# EAGLE design pp_module_rev_c (EAGLE 6.4)
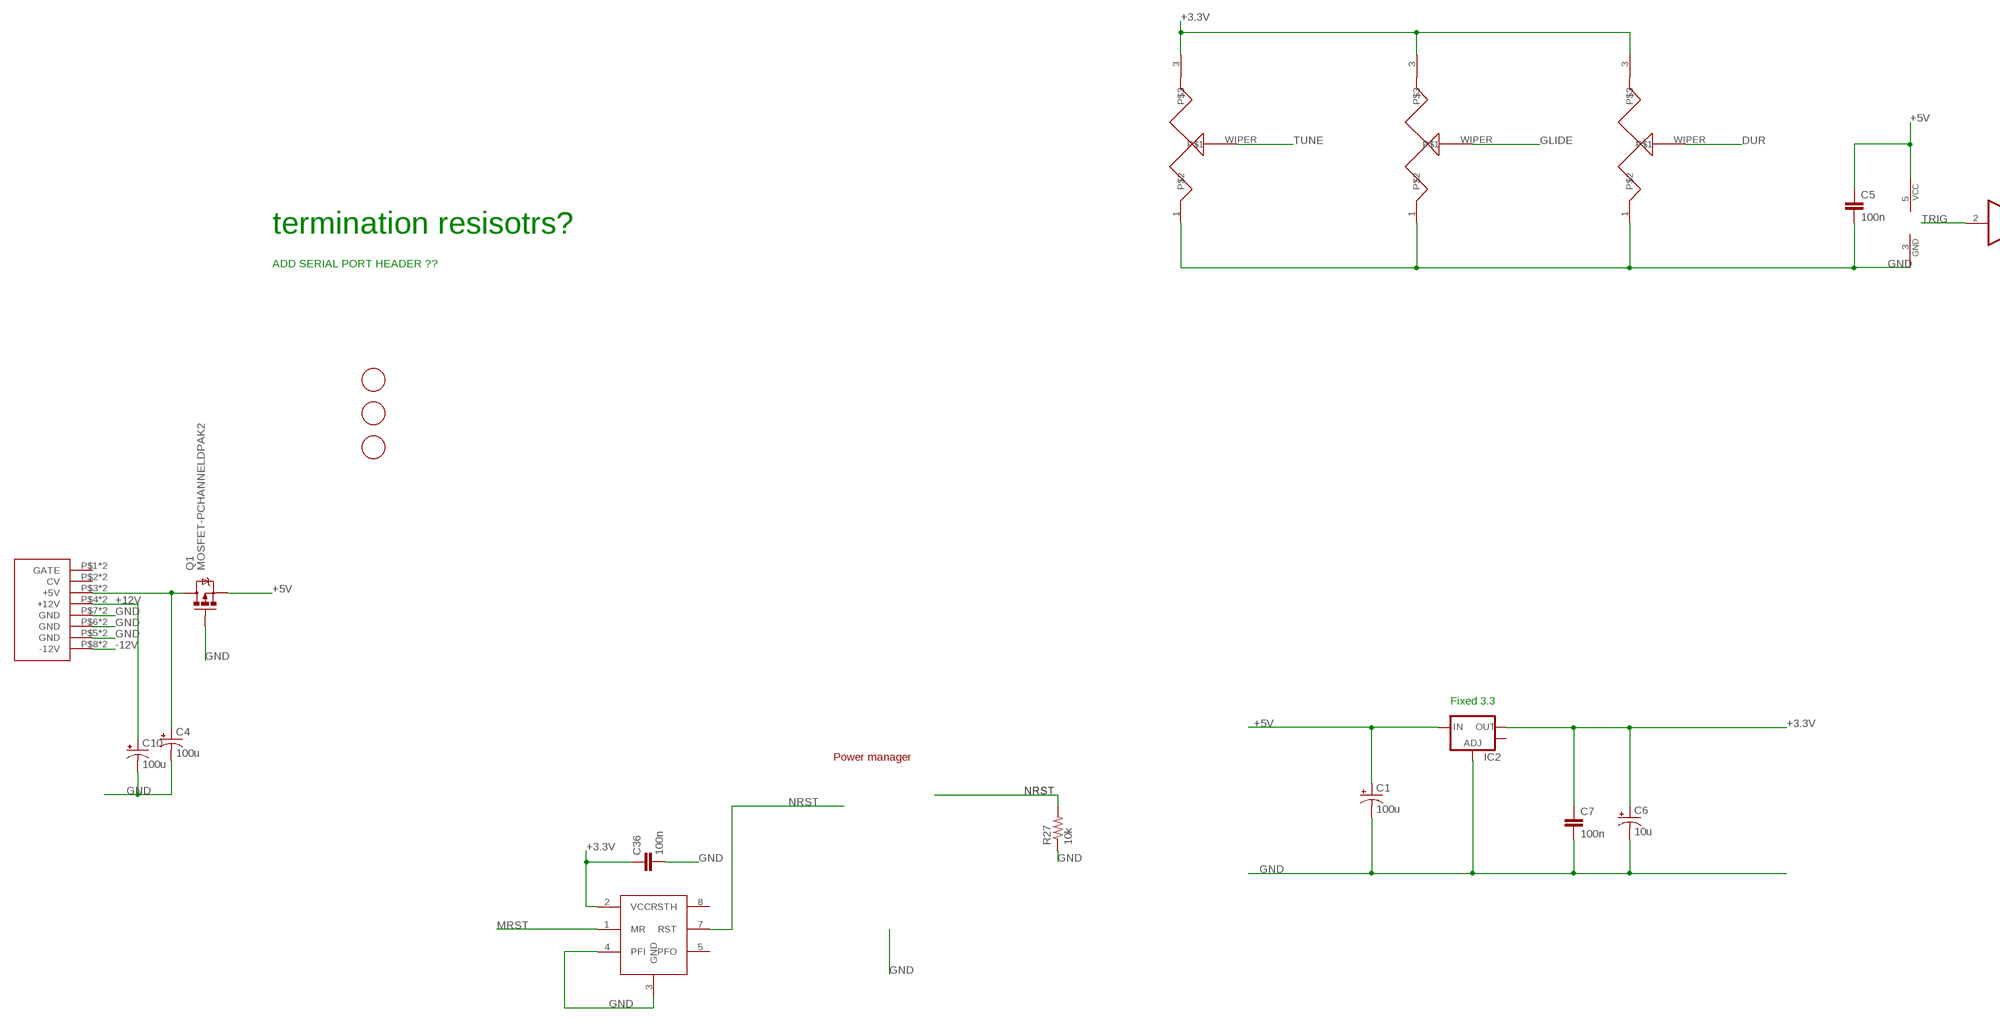
[diagram p0: schematic, sheet 1, part 1 of 3]
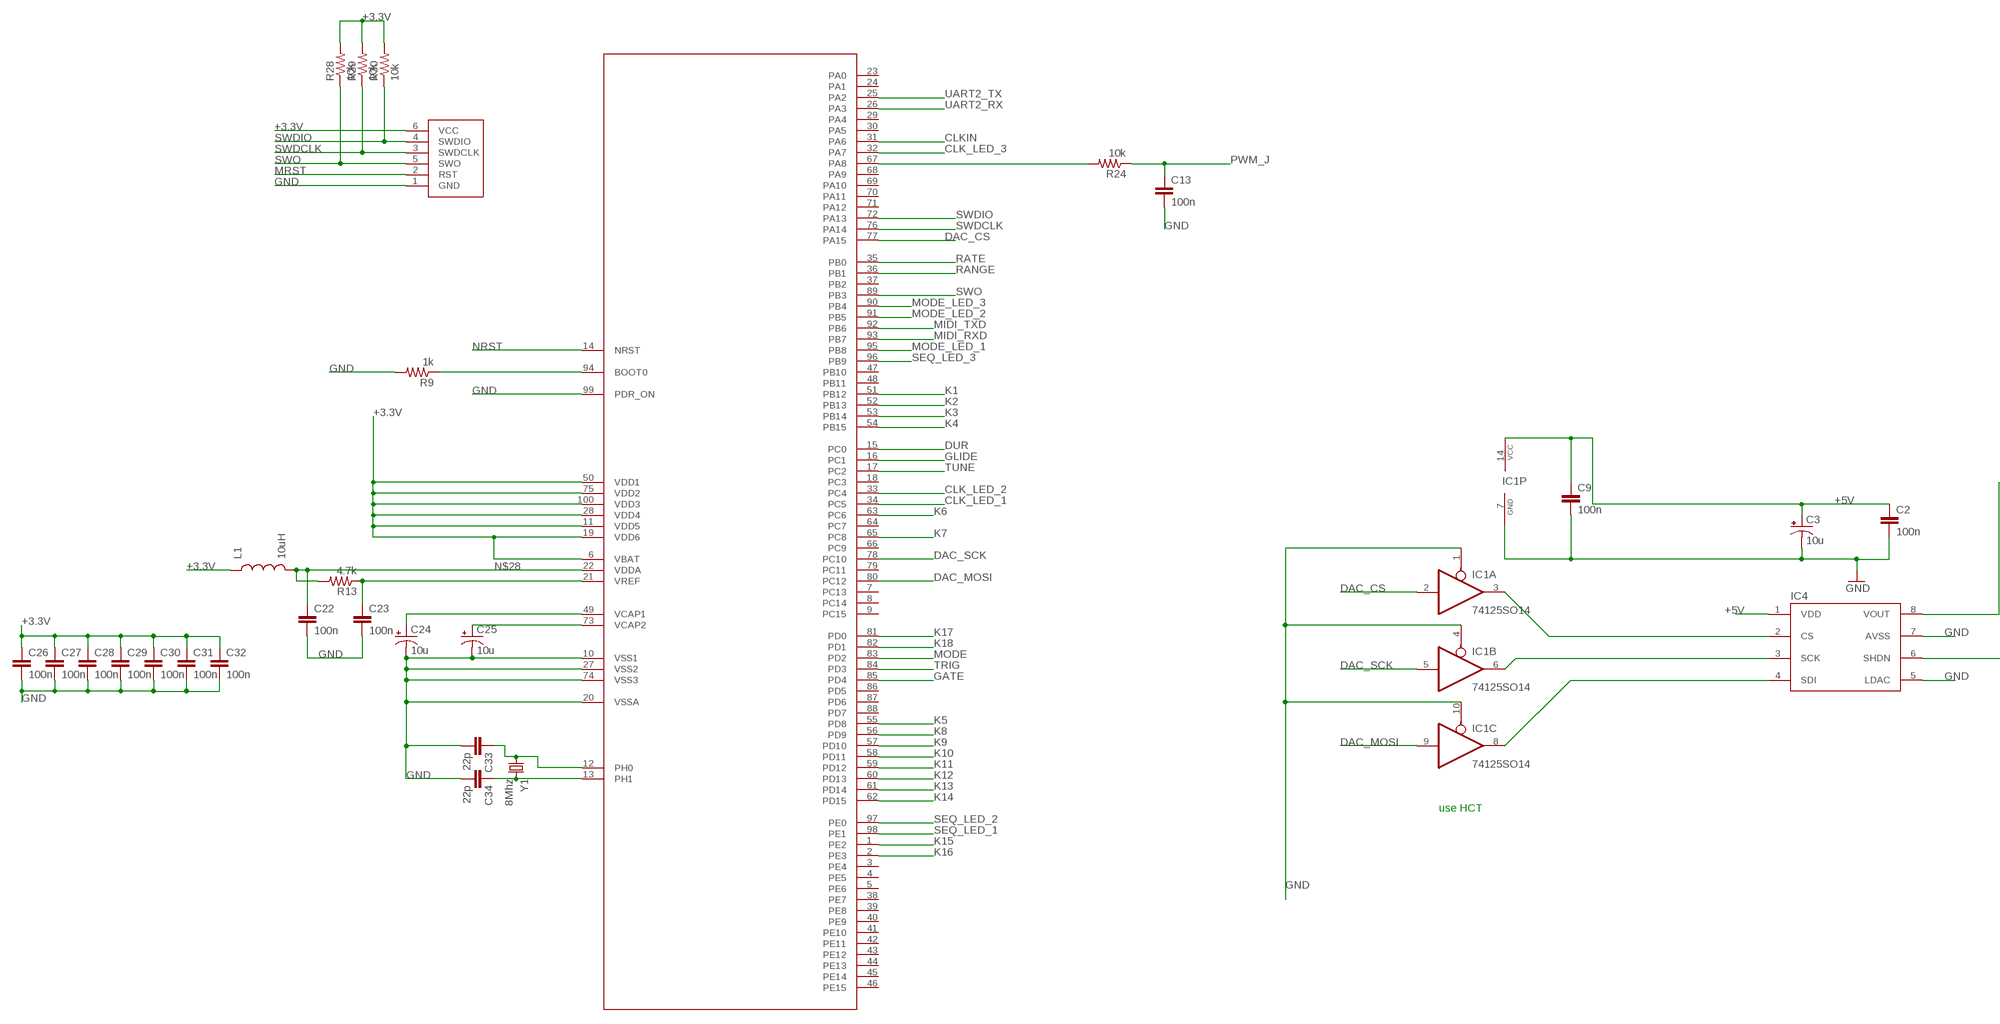
[diagram p1: schematic, sheet 1, part 2 of 3]
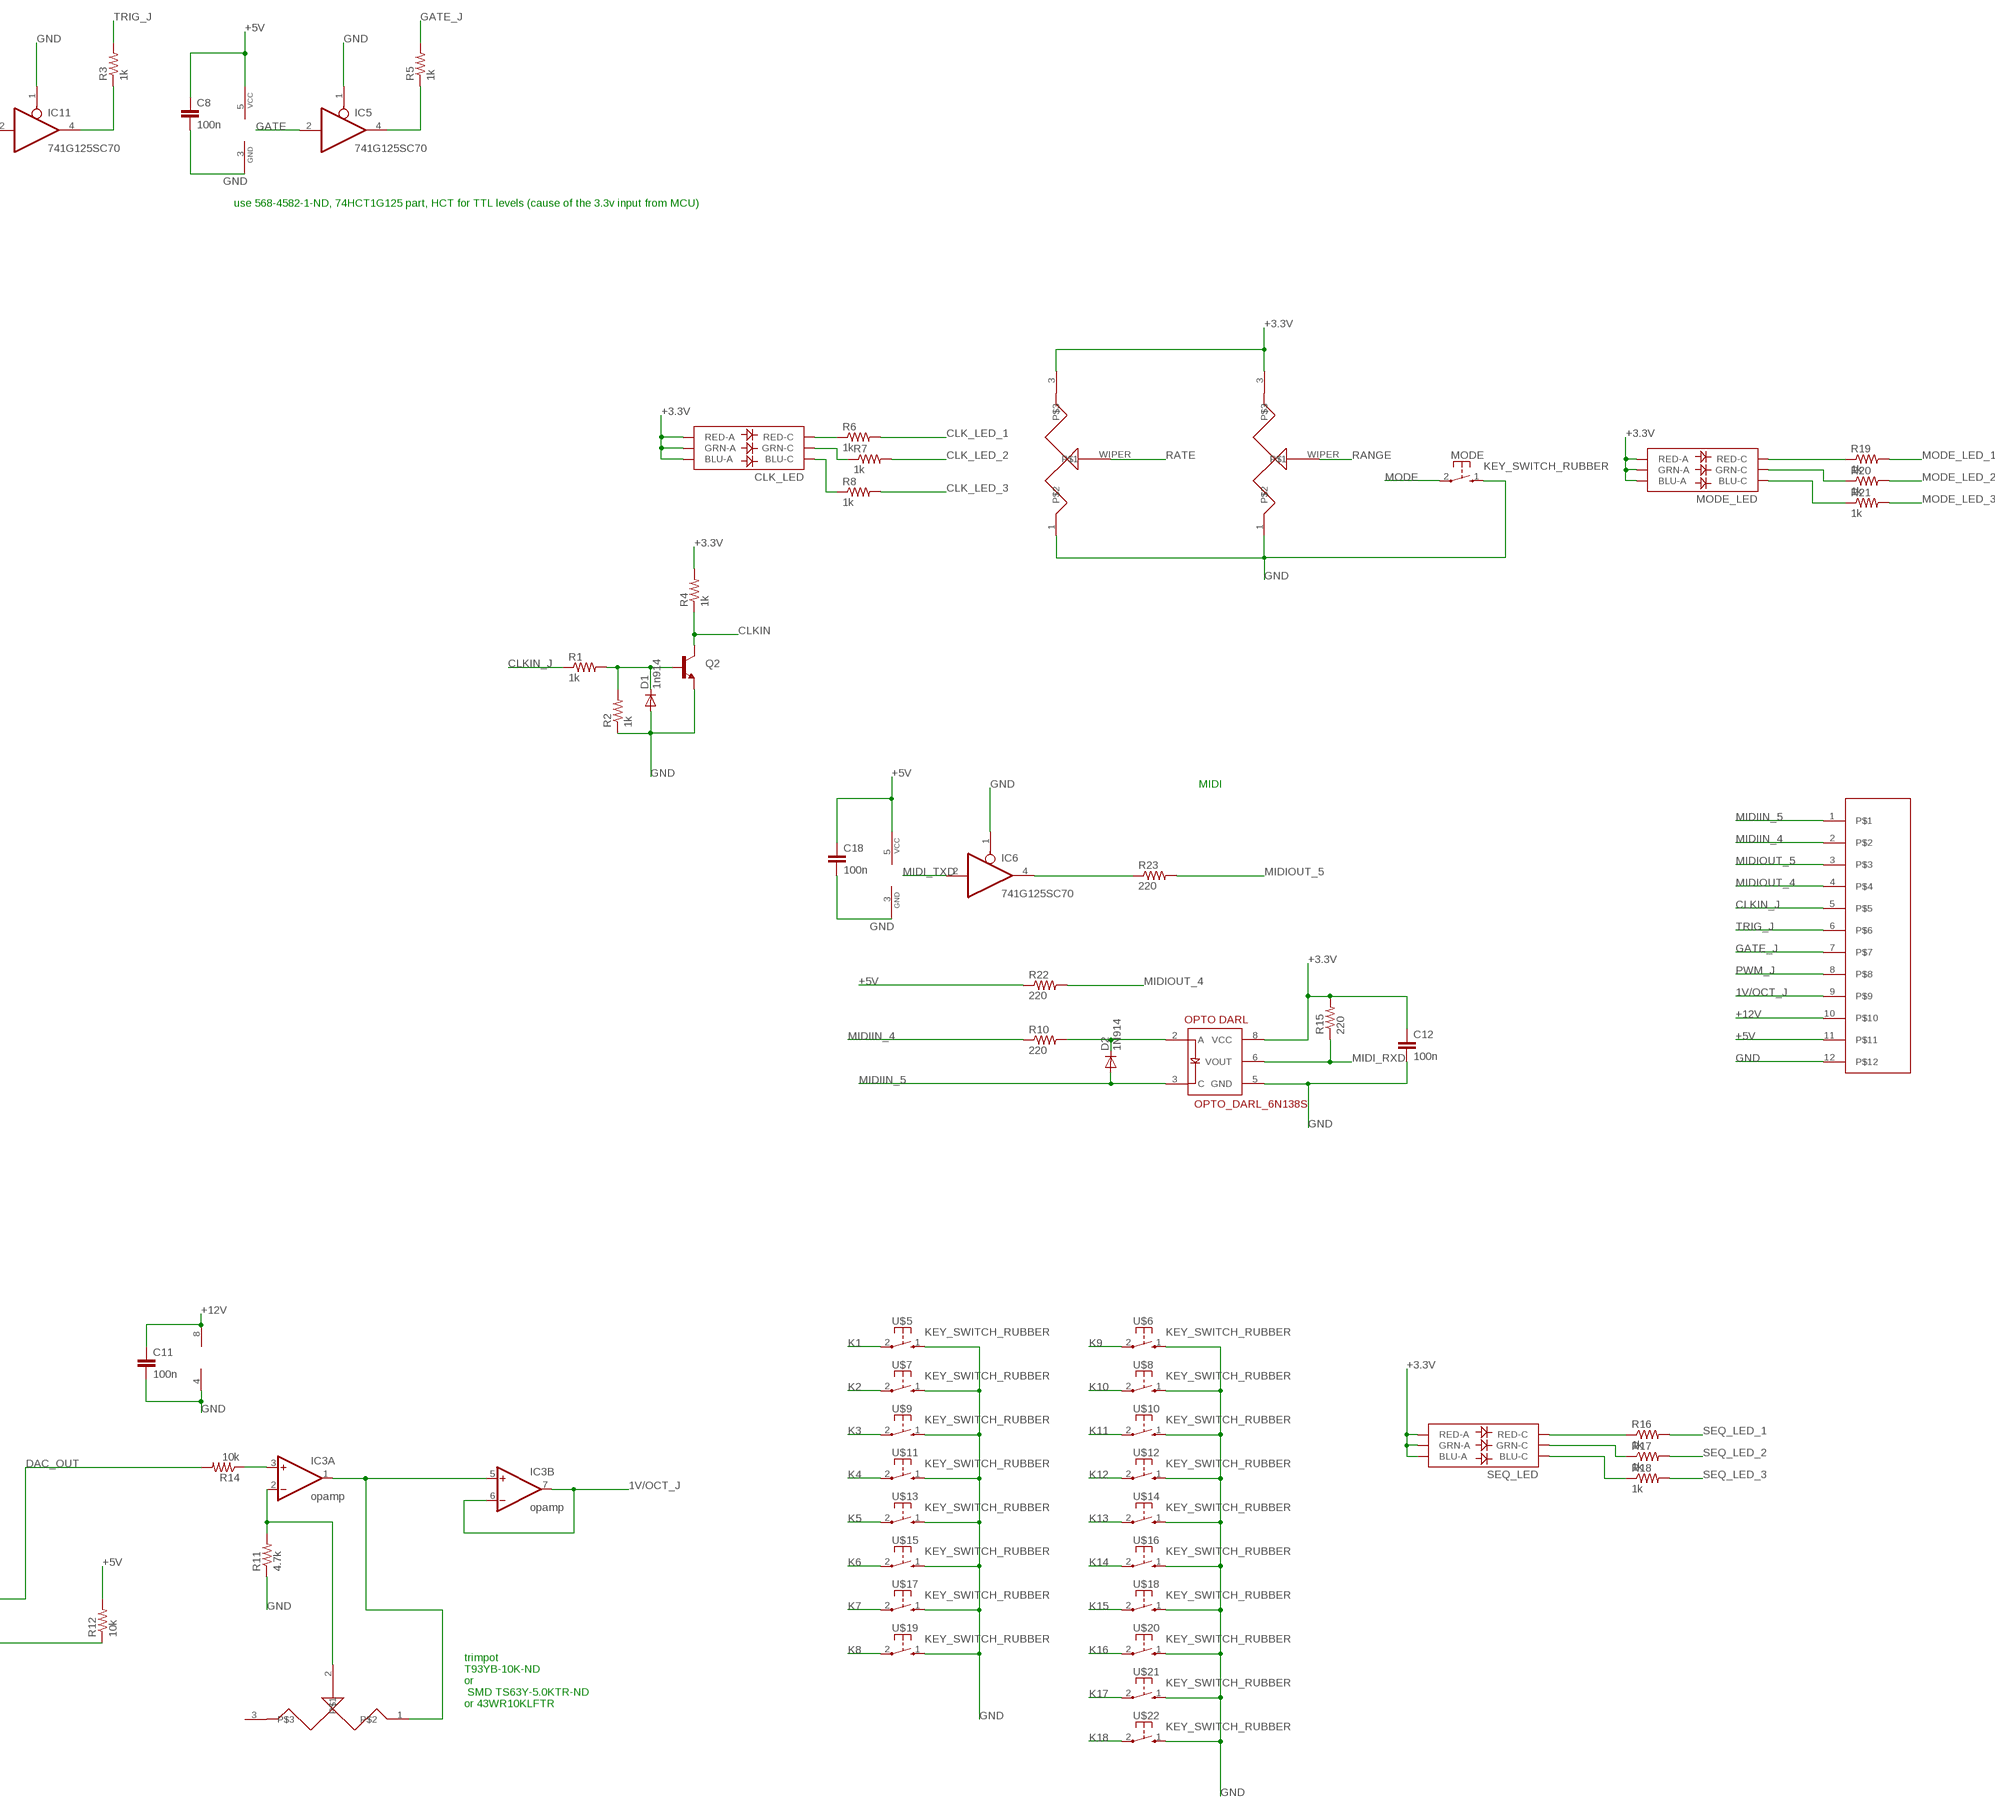
[diagram p2: schematic, sheet 1, part 3 of 3]

## Parts
C1  100u  CAP_POLD  [PANASONIC_D]
C2  100n  CAP0603-CAP  [0603-CAP]
C3  10u  CAP_POL1206  [EIA3216]
C4  100u  CAP_POLD  [PANASONIC_D]
C5  100n  CAP0603-CAP  [0603-CAP]
C6  10u  CAP_POL1206  [EIA3216]
C7  100n  CAP0603-CAP  [0603-CAP]
C8  100n  CAP0603-CAP  [0603-CAP]
C9  100n  CAP0603-CAP  [0603-CAP]
C10  100u  CAP_POLD  [PANASONIC_D]
C11  100n  CAP0603-CAP  [0603-CAP]
C12  100n  CAP0603-CAP  [0603-CAP]
C13  100n  CAP0603-CAP  [0603-CAP]
C18  100n  CAP0603-CAP  [0603-CAP]
C22  100n  CAP0603-CAP  [0603-CAP]
C23  100n  CAP0603-CAP  [0603-CAP]
C24  10u  CAP_POL1206  [EIA3216]
C25  10u  CAP_POL1206  [EIA3216]
C26  100n  CAP0603-CAP  [0603-CAP]
C27  100n  CAP0603-CAP  [0603-CAP]
C28  100n  CAP0603-CAP  [0603-CAP]
C29  100n  CAP0603-CAP  [0603-CAP]
C30  100n  CAP0603-CAP  [0603-CAP]
C31  100n  CAP0603-CAP  [0603-CAP]
C32  100n  CAP0603-CAP  [0603-CAP]
C33  22p  CAP0603-CAP  [0603-CAP]
C34  22p  CAP0603-CAP  [0603-CAP]
C36  100n  CAP0603-CAP  [0603-CAP]
CLK_LED  LED-TRICOLOR-5050  [LED-TRICOLOR-5050]
D1  1n914  DIODESOD  [SOD-323]
D2  1N914  DIODESOD  [SOD-323]
DUR  POTVERT  [POT-P09X-VERT]
GLIDE  POTVERT  [POT-P09X-VERT]
IC1  74125SO14  [SO14]
IC2  V_REG_LM1117SOT223  [SOT223]
IC3  opamp  2AMP_P8+4D  [SO08]
IC4  MCP4821  [SO08]
IC5  741G125SC70  [SC-70]
IC6  741G125SC70  [SC-70]
IC7  STM32F407VGT6  [LQFP100-14X14]
IC9  MAX708  [SO08]
IC11  741G125SC70  [SC-70]
L1  10uH  INDUCTOR0603  [0603]
MODE  KEY_SWITCH_RUBBER  [KEY_CONTACT_RUBBER]
MODE_LED  LED-TRICOLOR-5050  [LED-TRICOLOR-5050]
Q1  MOSFET-PCHANNELDPAK2  [DPAK2]
Q2  TRANSISTOR_NPNSOT23-3  [SOT23-3]
R1  1k  RESISTOR0603-RES  [0603-RES]
R2  1k  RESISTOR0603-RES  [0603-RES]
R3  1k  RESISTOR0603-RES  [0603-RES]
R4  1k  RESISTOR0603-RES  [0603-RES]
R5  1k  RESISTOR0603-RES  [0603-RES]
R6  1k  RESISTOR0603-RES  [0603-RES]
R7  1k  RESISTOR0603-RES  [0603-RES]
R8  1k  RESISTOR0603-RES  [0603-RES]
R9  1k  RESISTOR0603-RES  [0603-RES]
R10  220  RESISTOR0603-RES  [0603-RES]
R11  4.7k  RESISTOR0603-RES  [0603-RES]
R12  10k  RESISTOR0603-RES  [0603-RES]
R13  4.7k  RESISTOR0603-RES  [0603-RES]
R14  10k  RESISTOR0603-RES  [0603-RES]
R15  220  RESISTOR0603-RES  [0603-RES]
R16  1k  RESISTOR0603-RES  [0603-RES]
R17  1k  RESISTOR0603-RES  [0603-RES]
R18  1k  RESISTOR0603-RES  [0603-RES]
R19  1k  RESISTOR0603-RES  [0603-RES]
R20  1k  RESISTOR0603-RES  [0603-RES]
R21  1k  RESISTOR0603-RES  [0603-RES]
R22  220  RESISTOR0603-RES  [0603-RES]
R23  220  RESISTOR0603-RES  [0603-RES]
R24  10k  RESISTOR0603-RES  [0603-RES]
R27  10k  RESISTOR0603-RES  [0603-RES]
R28  10k  RESISTOR0603-RES  [0603-RES]
R29  10k  RESISTOR0603-RES  [0603-RES]
R30  10k  RESISTOR0603-RES  [0603-RES]
RANGE  POTVERT  [POT-P09X-VERT]
RATE  POTVERT  [POT-P09X-VERT]
SEQ_LED  LED-TRICOLOR-5050  [LED-TRICOLOR-5050]
SWD  SWD6PIN  [2X3]
TUNE  POTVERT  [POT-P09X-VERT]
U$1  FIDUCIAL  [FIDUCIAL_1MM]
U$2  POTSMD-TRIMMER  [POT-TRIM-TT-43]
U$3  CARDEDGE_12POS_MALE  [CARDEDGE_12POS_MALE]
U$4  OPTO_DARL_6N138S  [8-SMD]
U$5  KEY_SWITCH_RUBBER  [KEY_CONTACT_RUBBER]
U$6  KEY_SWITCH_RUBBER  [KEY_CONTACT_RUBBER]
U$7  KEY_SWITCH_RUBBER  [KEY_CONTACT_RUBBER]
U$8  KEY_SWITCH_RUBBER  [KEY_CONTACT_RUBBER]
U$9  KEY_SWITCH_RUBBER  [KEY_CONTACT_RUBBER]
U$10  KEY_SWITCH_RUBBER  [KEY_CONTACT_RUBBER]
U$11  KEY_SWITCH_RUBBER  [KEY_CONTACT_RUBBER]
U$12  KEY_SWITCH_RUBBER  [KEY_CONTACT_RUBBER]
U$13  KEY_SWITCH_RUBBER  [KEY_CONTACT_RUBBER]
U$14  KEY_SWITCH_RUBBER  [KEY_CONTACT_RUBBER]
U$15  KEY_SWITCH_RUBBER  [KEY_CONTACT_RUBBER]
U$16  KEY_SWITCH_RUBBER  [KEY_CONTACT_RUBBER]
U$17  KEY_SWITCH_RUBBER  [KEY_CONTACT_RUBBER]
U$18  KEY_SWITCH_RUBBER  [KEY_CONTACT_RUBBER]
U$19  KEY_SWITCH_RUBBER  [KEY_CONTACT_RUBBER]
U$20  KEY_SWITCH_RUBBER  [KEY_CONTACT_RUBBER]
U$21  KEY_SWITCH_RUBBER  [KEY_CONTACT_RUBBER]
U$22  KEY_SWITCH_RUBBER  [KEY_CONTACT_RUBBER]
U$23  FIDUCIAL  [FIDUCIAL_1MM]
U$24  FIDUCIAL  [FIDUCIAL_1MM]
U$33  DOEPFER_16_CONNSMD  [2X8SMD]
Y1  8Mhz  CRYSTALABA  [CRYSTAL-SMD]

## Nets
1N914: D1.1(C) Q2.1(B) R1.2 R2.2
1V/OCT_J: IC3.6(B:-IN) IC3.7(B:OUT) U$3.9
+3.3V [power]: C6.A(+) C7.1 C12.1 C26.1 C27.1 C28.1 C29.1 C30.1 C31.1 C32.1 C36.1 CLK_LED.1(BLU-A) CLK_LED.3(GRN-A) CLK_LED.5(RED-A) DUR.3 GLIDE.3 IC2.2(OUT) IC7.6(VBAT) IC7.11(VDD5) IC7.19(VDD6) IC7.28(VDD4) IC7.50(VDD1) IC7.75(VDD2) IC7.100(VDD3) IC9.2(VCC) L1.1 MODE_LED.1(BLU-A) MODE_LED.3(GRN-A) MODE_LED.5(RED-A) R4.2 R15.2 R28.2 R29.2 R30.2 RANGE.3 RATE.3 SEQ_LED.1(BLU-A) SEQ_LED.3(GRN-A) SEQ_LED.5(RED-A) SWD.6(VCC) TUNE.3 U$4.8(VCC)
+5V [power]: C1.+ C2.1 C3.A(+) C5.1 C8.1 C9.1 C18.1 IC1.14(P:VCC) IC2.3(IN) IC4.1(VDD) IC5.5(VCC) IC6.5(VCC) IC11.5(VCC) Q1.3(S) R12.2 R22.1 U$3.11
+12V: C10.+ C11.1 IC3.8(P:V+) U$3.10 U$33.P$4(+12V) U$33.P$12(+12V)
-12V: U$33.P$8(-12V) U$33.P$16(-12V)
CLK_LED_1: IC7.34(PC5) R6.2
CLK_LED_2: IC7.33(PC4) R7.2
CLK_LED_3: IC7.32(PA7) R8.2
CLKIN: IC7.31(PA6) Q2.3(C) R4.1
CLKIN_J: R1.1 U$3.5
DAC_CS: IC1.2(A:I) IC7.77(PA15)
DAC_MOSI: IC1.9(C:I) IC7.80(PC12)
DAC_OUT: IC4.8(VOUT) R14.2
DAC_SCK: IC1.5(B:I) IC7.78(PC10)
DUR: DUR.WIPER IC7.15(PC0)
GATE: IC5.2(I) IC7.85(PD4)
GATE_J: R5.2 U$3.7
GLIDE: GLIDE.WIPER IC7.16(PC1)
GND: C1.- C2.2 C3.C(-) C4.- C5.2 C6.C(-) C7.2 C8.2 C9.2 C10.- C11.2 C12.2 C13.2 C18.2 C22.2 C23.2 C24.C(-) C25.C(-) C26.2 C27.2 C28.2 C29.2 C30.2 C31.2 C32.2 C33.2 C34.2 C36.2 D1.2(A) DUR.1 GLIDE.1 IC1.1(A:OE) IC1.4(B:OE) IC1.7(P:GND) IC1.10(C:OE) IC2.1(ADJ) IC3.4(P:V-) IC4.5(LDAC) IC4.7(AVSS) IC5.1(OE) IC5.3(GND) IC6.1(OE) IC6.3(GND) IC7.10(VSS1) IC7.20(VSSA) IC7.27(VSS2) IC7.74(VSS3) IC7.99(PDR_ON) IC9.3(GND) IC9.4(PFI) IC11.1(OE) IC11.3(GND) MODE.1 Q1.1(G) Q2.2(E) R2.1 R9.2 R11.1 R27.1 RANGE.1 RATE.1 SWD.1(GND) TUNE.1 U$3.12 U$4.5(GND) U$5.1 U$6.1 U$7.1 U$8.1 U$9.1 U$10.1 U$11.1 U$12.1 U$13.1 U$14.1 U$15.1 U$16.1 U$17.1 U$18.1 U$19.1 U$20.1 U$21.1 U$22.1 U$33.P$5(GND) U$33.P$6(GND) U$33.P$7(GND) U$33.P$13(GND) U$33.P$14(GND) U$33.P$15(GND)
K1: IC7.51(PB12) U$5.2
K2: IC7.52(PB13) U$7.2
K3: IC7.53(PB14) U$9.2
K4: IC7.54(PB15) U$11.2
K5: IC7.55(PD8) U$13.2
K6: IC7.63(PC6) U$15.2
K7: IC7.65(PC8) U$17.2
K8: IC7.56(PD9) U$19.2
K9: IC7.57(PD10) U$6.2
K10: IC7.58(PD11) U$8.2
K11: IC7.59(PD12) U$10.2
K12: IC7.60(PD13) U$12.2
K13: IC7.61(PD14) U$14.2
K14: IC7.62(PD15) U$16.2
K15: IC7.1(PE2) U$18.2
K16: IC7.2(PE3) U$20.2
K17: IC7.81(PD0) U$21.2
K18: IC7.82(PD1) U$22.2
MIDI_RXD: IC7.93(PB7) R15.1 U$4.6(VOUT)
MIDI_TXD: IC6.2(I) IC7.92(PB6)
MIDIIN_4: R10.1 U$3.2
MIDIIN_5: D2.2(A) U$3.1 U$4.3(C)
MIDIOUT_4: R22.2 U$3.4
MIDIOUT_5: R23.2 U$3.3
MODE: IC7.83(PD2) MODE.2
MODE_LED_1: IC7.95(PB8) R19.2
MODE_LED_2: IC7.91(PB5) R20.2
MODE_LED_3: IC7.90(PB4) R21.2
MRST: IC9.1(MR) SWD.2(RST)
N$1: MODE_LED.6(RED-C) R19.1
N$2: MODE_LED.4(GRN-C) R20.1
N$3: C34.1 IC7.13(PH1) Y1.2
N$4: MODE_LED.2(BLU-C) R21.1
N$5: C24.A(+) IC7.49(VCAP1)
N$6: C33.1 IC7.12(PH0) Y1.1
N$7: IC3.2(A:-IN) R11.2 U$2.2
N$8: IC3.3(A:+IN) R14.1
N$9: C4.+ Q1.4(D) U$33.P$3(+5V) U$33.P$11(+5V)
N$10: IC11.4(O) R3.1
N$11: CLK_LED.6(RED-C) R6.1
N$12: IC5.4(O) R5.1
N$13: IC7.67(PA8) R24.2
N$14: CLK_LED.4(GRN-C) R7.1
N$15: CLK_LED.2(BLU-C) R8.1
N$17: C25.A(+) IC7.73(VCAP2)
N$18: IC4.6(SHDN) R12.1
N$19: R18.1 SEQ_LED.2(BLU-C)
N$20: R17.1 SEQ_LED.4(GRN-C)
N$21: IC7.94(BOOT0) R9.1
N$22: R16.1 SEQ_LED.6(RED-C)
N$24: IC3.1(A:OUT) IC3.5(B:+IN) U$2.1
N$27: IC1.3(A:O) IC4.2(CS)
N$28: C22.1 IC7.22(VDDA) L1.2 R13.2
N$29: C23.1 IC7.21(VREF) R13.1
N$30: D2.1(C) R10.2 U$4.2(A)
N$34: IC6.4(O) R23.1
N$36: IC1.6(B:O) IC4.3(SCK)
N$37: IC1.8(C:O) IC4.4(SDI)
NRST: IC7.14(NRST) IC9.7(RST) R27.2
PWM_J: C13.1 R24.1 U$3.8
RANGE: IC7.36(PB1) RANGE.WIPER
RATE: IC7.35(PB0) RATE.WIPER
SEQ_LED_1: IC7.98(PE1) R16.2
SEQ_LED_2: IC7.97(PE0) R17.2
SEQ_LED_3: IC7.96(PB9) R18.2
SWDCLK: IC7.76(PA14) R29.1 SWD.3(SWDCLK)
SWDIO: IC7.72(PA13) R30.1 SWD.4(SWDIO)
SWO: IC7.89(PB3) R28.1 SWD.5(SWO)
TRIG: IC7.84(PD3) IC11.2(I)
TRIG_J: R3.2 U$3.6
TUNE: IC7.17(PC2) TUNE.WIPER
UART2_RX: IC7.26(PA3)
UART2_TX: IC7.25(PA2)
Unconnected: IC1.11(D:O) IC1.12(D:I) IC1.13(D:OE) IC2.4(OUT) IC7.3(PE4) IC7.4(PE5) IC7.5(PE6) IC7.7(PC13) IC7.8(PC14) IC7.9(PC15) IC7.18(PC3) IC7.23(PA0) IC7.24(PA1) IC7.29(PA4) IC7.30(PA5) IC7.37(PB2) IC7.38(PE7) IC7.39(PE8) IC7.40(PE9) IC7.41(PE10) IC7.42(PE11) IC7.43(PE12) IC7.44(PE13) IC7.45(PE14) IC7.46(PE15) IC7.47(PB10) IC7.48(PB11) IC7.64(PC7) IC7.66(PC9) IC7.68(PA9) IC7.69(PA10) IC7.70(PA11) IC7.71(PA12) IC7.79(PC11) IC7.86(PD5) IC7.87(PD6) IC7.88(PD7) IC9.5(PFO) IC9.8(RSTH) U$2.3 U$33.P$1(GATE) U$33.P$2(CV) U$33.P$9(GATE) U$33.P$10(CV)

## Notes on the sheet
- termination resisotrs?
- ADD SERIAL PORT HEADER ??
- use 568-4582-1-ND, 74HCT1G125 part, HCT for TTL levels (cause of the 3.3v input from MCU)
- Fixed 3.3
- Power manager
- MIDI
- trimpot 
  T93YB-10K-ND
  or 
   SMD TS63Y-5.0KTR-ND
  or 43WR10KLFTR
- use HCT

## Library data of the parts
C1 C4 C10 = osborn:CAP_POL: Capacitor Polarized These are standard SMD and PTH capacitors. Normally 10uF, 47uF, and 100uF in electrolytic and tantalum varieties. Always verify the external diameter of the through hole cap, it varies with capacity, voltage, and manufacturer. The EIA devices should be standard.; CID: 68
C2 C5 C8 C9 C11-C13 C18 C22 C23 C26-C32 C36 = osborn:CAP: Capacitor Standard 0603 ceramic capacitor, and 0.1" leaded capacitor.; CID: 67
C3 C6 C24 C25 = osborn:CAP_POL: Capacitor Polarized These are standard SMD and PTH capacitors. Normally 10uF, 47uF, and 100uF in electrolytic and tantalum varieties. Always verify the external diameter of the through hole cap, it varies with capacity, voltage, and manufacturer. The EIA devices should be standard.; CID: 70
C7 = osborn:CAP: Capacitor Standard 0603 ceramic capacitor, and 0.1" leaded capacitor.
C33 C34 = osborn:CAP: Capacitor Standard 0603 ceramic capacitor, and 0.1" leaded capacitor.; CID: 75
CLK_LED MODE_LED SEQ_LED = osborn:LED-TRICOLOR-5050; CID: 27
D1 D2 = osborn:DIODE: Diode These are standard reverse protection diodes and small signal diodes. SMA package can handle up to about 1A. SOD-323 can handle about 200mA. What the SOD-323 package when ordering, there are some mfgs out there that are 5-pin packages.; CID: 90
DUR GLIDE RANGE RATE TUNE = osborn:POT; CID: 161
IC1 = osborn:74*125: Quad bus BUFFER, 3-state; CID: 164
IC2 = osborn:V_REG_LM1117: Voltage Regulator LM1117 Standard adjustable voltage regulator but in SMD form. Spark Fun Electronics SKU : COM-00595; CID: 121
IC3 = osborn:2AMP_P8+4: OP AMP; CID: 168
IC4 = osborn:MCP4821; CID: 162
IC5 IC6 IC11 = osborn:741G125; CID: 165
IC7 = osborn:STM32F407VGT6; CID: 126; DIGIKEY: 497-11605-ND; MOUSER: 511-STM32F407VGT6
IC9 = osborn:MAX708; CID: 128
L1 = osborn:INDUCTOR: Inductors Basic Inductor/Choke - 0603 and 1206. Footprints are not proven and vary greatly between part numbers.; CID: 129
MODE U$5-U$22 = osborn:KEY_SWITCH_RUBBER
Q1 = osborn:MOSFET-PCHANNEL; CID: 130
Q2 = osborn:TRANSISTOR_NPN: Transistor NPN BJT configuration in SOT23 package. MMBT2222 is the common NPN we use. Double check BCE configuration again layout.; CID: 167
R1 R2 R4 R6-R9 R16-R21 = osborn:RESISTOR: Resistor Basic schematic elements and footprints for 0603, 1206, and PTH resistors.; CID: 72
R3 R5 = osborn:RESISTOR: Resistor Basic schematic elements and footprints for 0603, 1206, and PTH resistors.; CID: 102
R10 R15 R22 R23 = osborn:RESISTOR: Resistor Basic schematic elements and footprints for 0603, 1206, and PTH resistors.; CID: 108
R11 R13 = osborn:RESISTOR: Resistor Basic schematic elements and footprints for 0603, 1206, and PTH resistors.; CID: 78
R12 = osborn:RESISTOR: Resistor Basic schematic elements and footprints for 0603, 1206, and PTH resistors.
R14 = osborn:RESISTOR: Resistor Basic schematic elements and footprints for 0603, 1206, and PTH resistors.; CID: 105
R24 R27-R30 = osborn:RESISTOR: Resistor Basic schematic elements and footprints for 0603, 1206, and PTH resistors.; CID: 69
SWD = osborn:SWD
U$1 U$23 U$24 = osborn:FIDUCIAL: For use by pick and place machines to calibrate the vision/machine, 1mm By microbuilder.eu
U$2 = osborn:POT; CID: 166
U$3 = osborn:CARDEDGE_12POS_MALE
U$4 = SparkFun-20110623:OPTO_DARL_6N138S; CID: 91
U$33 = osborn:DOEPFER_16_CONN; CID: 163
Y1 = osborn:CRYSTAL: Crystals Various standard crystals. Proven footprints. Spark Fun Electronics SKU : COM-00534; CID: 140

## Net classes
0 default: width 0.254 mm
1 power: width 0.254 mm

## Board
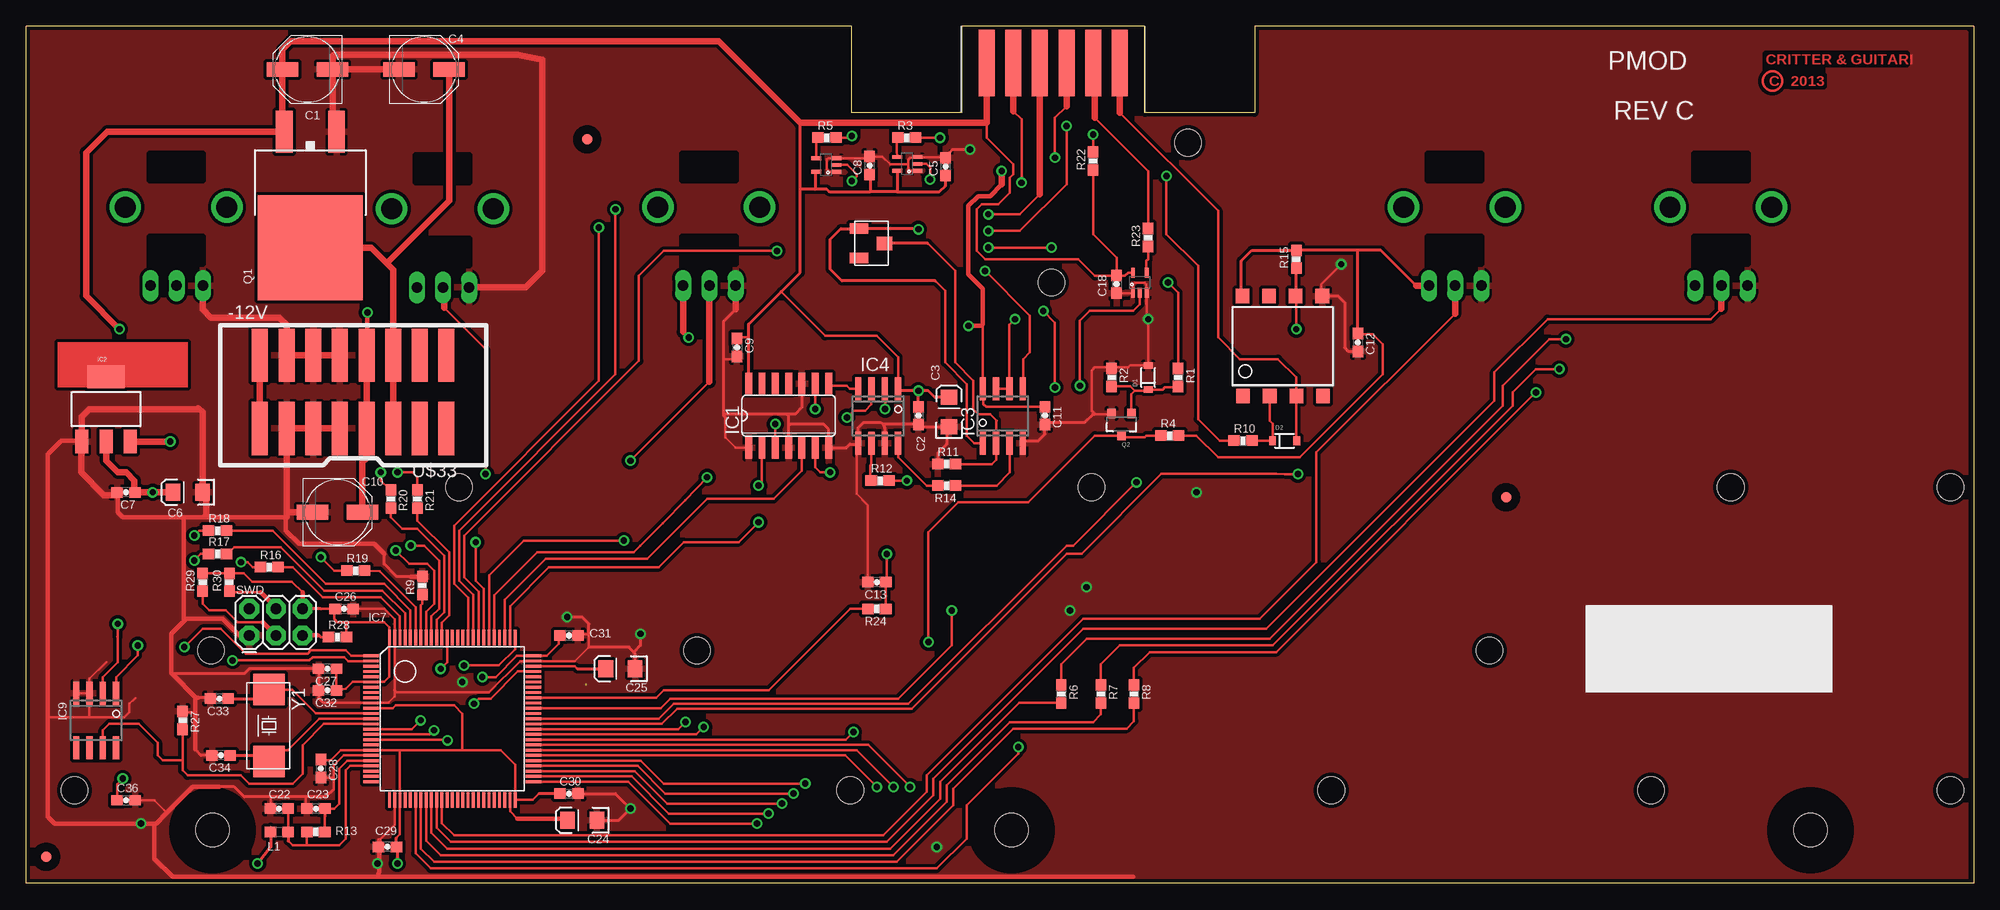
[diagram p3: board, top side]
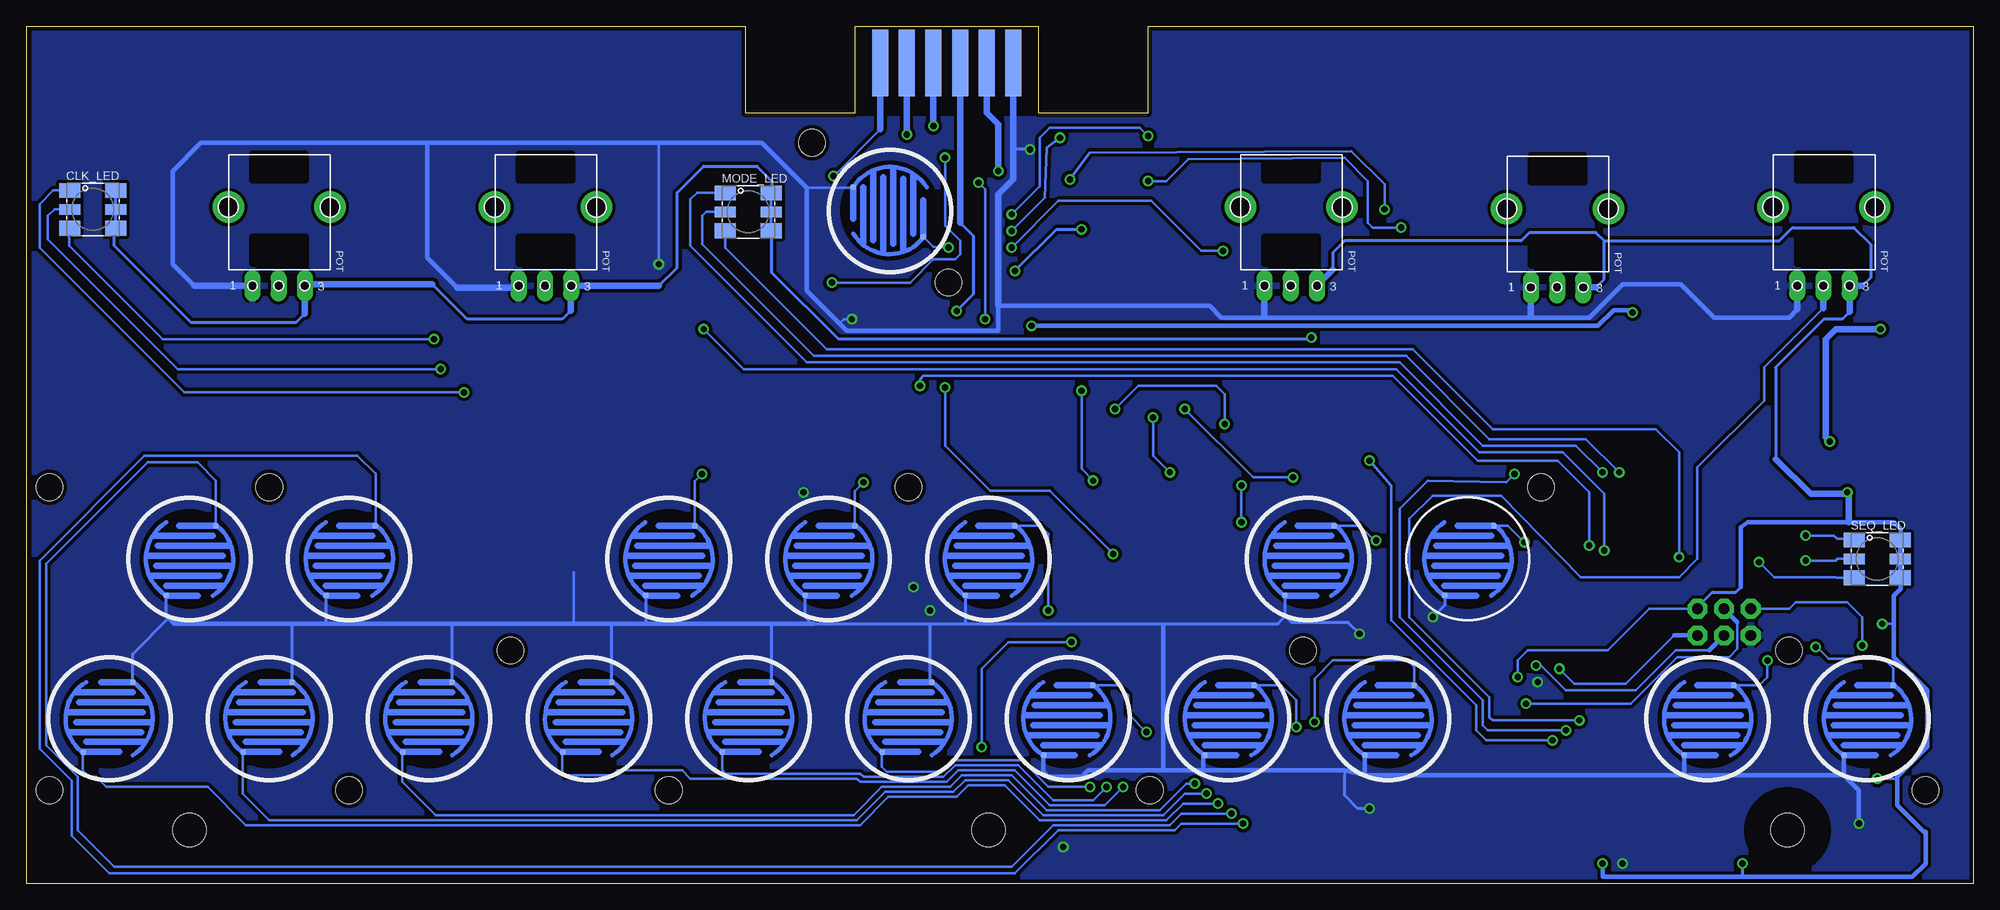
[diagram p4: board, bottom side, seen from below]

Size 185.74 x 81.76 mm. Coordinates in mm from the lower left corner, seen from the top.
Outline: 185.74,81.76 185.74,0 0,0 0,81.76 78.74,81.76 78.74,73.5 89.22,73.5 89.22,81.76 106.68,81.76 106.68,73.5 117.16,73.5 117.16,81.76 185.74,81.76
Copper layers (1*16): Top 0.035mm / dielectric 1.5mm / Bottom 0.035mm
Design rules "default": minimum track width 10mil, minimum drill 20mil, track to track 8mil, track to pad 8mil, pad to pad 8mil, via to via 8mil, smd to smd 8mil, copper to edge 15mil, drill to drill 8mil, minimum pad ring 10mil, minimum via ring 8mil, stop-mask expansion 4mil, vias tented up to drill 0mil, thermal gap 10mil
Holes 3.2 mm at 170.17,5.09 17.77,5.09 93.97,5.09
Holes 2.54 mm at 139.54,22.23 63.98,22.23 17.62,22.23 162.56,37.78 101.6,37.78 154.94,8.89 124.46,8.89 78.58,8.89 4.6,8.89 183.52,8.89 183.52,37.78 41.28,37.78 110.81,70.64 97.79,57.31
tRestrict: area 14,1.3 to 21.6,8.9; area 90.2,1.3 to 97.8,8.9; area 166.4,1.3 to 174,8.9
bRestrict: area 14,1.3 to 21.6,8.9; area 90.2,1.3 to 97.8,8.9; area 166.4,1.3 to 174,8.9

### Footprints (pad centres in the part's own frame; a part is rotated, then mirrored left to right if it is on the bottom)
PANASONIC_D = smd 3 x 1.4: + 2.4,0; - -2.4,0
0603-CAP = smd 1.1 x 1: 1 -0.85,0; 2 0.85,0
EIA3216 = smd 1.4 x 1.6: A 1.4,0; C -1.4,0
LED-TRICOLOR-5050 = smd 2 x 1.4: 1 2.2,1.8; 2 -2.2,1.8; 5 2.2,-1.8; 6 -2.2,-1.8 | smd 2 x 1: 3 2.2,0; 4 -2.2,0
SOD-323 = smd 0.63 x 0.83: 1 -1.15,0; 2 1.15,0
POT-P09X-VERT = drill 1 pad 1.27 long: 1 -2.54,-7.51; 3 2.46,-7.51; WIPER -0.04,-7.51 | drill 2 pad 2.54: P$4 4.86,-0.01; P$5 -4.84,-0.01
SO14 = smd 0.66 x 2.032: 1 -3.81,-3.073; 2 -2.54,-3.073; 3 -1.27,-3.073; 4 0,-3.073; 5 1.27,-3.073; 6 2.54,-3.073; 7 3.81,-3.073; 8 3.81,3.073; 9 2.54,3.073; 10 1.27,3.073; 11 0,3.073; 12 -1.27,3.073; 13 -2.54,3.073; 14 -3.81,3.073
SOT223 = smd 1.219 x 2.235: 1 -2.311,-3.099; 2 0,-3.099; 3 2.311,-3.099 | smd 3.6 x 2.2: 4 0,3.099
SO08 = smd 0.6 x 2.2: 1 -1.905,-2.6; 2 -0.635,-2.6; 3 0.635,-2.6; 4 1.905,-2.6; 5 1.905,2.6; 6 0.635,2.6; 7 -0.635,2.6; 8 -1.905,2.6
SC-70 = smd 0.36 x 0.95: 1 -0.65,-0.95; 2 0,-0.95; 3 0.65,-0.95; 4 0.65,0.95; 5 -0.65,0.95
LQFP100-14X14 = smd 0.27 x 1.5: 1 -6,-7.75; 2 -5.5,-7.75; 3 -5,-7.75; 4 -4.5,-7.75; 5 -4,-7.75; 6 -3.5,-7.75; 7 -3,-7.75; 8 -2.5,-7.75; 9 -2,-7.75; 10 -1.5,-7.75; 11 -1,-7.75; 12 -0.5,-7.75; 13 0,-7.75; 14 0.5,-7.75; 15 1,-7.75; 16 1.5,-7.75; 17 2,-7.75; 18 2.5,-7.75; 19 3,-7.75; 20 3.5,-7.75; 21 4,-7.75; 22 4.5,-7.75; 23 5,-7.75; 24 5.5,-7.75; 25 6,-7.75; 51 6,7.75; 52 5.5,7.75; 53 5,7.75; 54 4.5,7.75; 55 4,7.75; 56 3.5,7.75; 57 3,7.75; 58 2.5,7.75; 59 2,7.75; 60 1.5,7.75; 61 1,7.75; 62 0.5,7.75; 63 0,7.75; 64 -0.5,7.75; 65 -1,7.75; 66 -1.5,7.75; 67 -2,7.75; 68 -2.5,7.75; 69 -3,7.75; 70 -3.5,7.75; 71 -4,7.75; 72 -4.5,7.75; 73 -5,7.75; 74 -5.5,7.75; 75 -6,7.75 | smd 1.5 x 0.27: 26 7.75,-6; 27 7.75,-5.5; 28 7.75,-5; 29 7.75,-4.5; 30 7.75,-4; 31 7.75,-3.5; 32 7.75,-3; 33 7.75,-2.5; 34 7.75,-2; 35 7.75,-1.5; 36 7.75,-1; 37 7.75,-0.5; 38 7.75,0; 39 7.75,0.5; 40 7.75,1; 41 7.75,1.5; 42 7.75,2; 43 7.75,2.5; 44 7.75,3; 45 7.75,3.5; 46 7.75,4; 47 7.75,4.5; 48 7.75,5; 49 7.75,5.5; 50 7.75,6; 76 -7.75,6; 77 -7.75,5.5; 78 -7.75,5; 79 -7.75,4.5; 80 -7.75,4; 81 -7.75,3.5; 82 -7.75,3; 83 -7.75,2.5; 84 -7.75,2; 85 -7.75,1.5; 86 -7.75,1; 87 -7.75,0.5; 88 -7.75,0; 89 -7.75,-0.5; 90 -7.75,-1; 91 -7.75,-1.5; 92 -7.75,-2; 93 -7.75,-2.5; 94 -7.75,-3; 95 -7.75,-3.5; 96 -7.75,-4; 97 -7.75,-4.5; 98 -7.75,-5; 99 -7.75,-5.5; 100 -7.75,-6
0603 = smd 1.1 x 1: 1 -0.85,0; 2 0.85,0
KEY_CONTACT_RUBBER = smd 0.508 x 0.508: 1 -3.482,2.2; 2 3.183,-2.5
DPAK2 = smd 1.6 x 4: 1 -2.5,-10; 3 2.5,-10 | smd 10 x 10: 4 0,1.088
SOT23-3 = smd 0.8 x 0.9: 1 -0.95,-1; 2 0.95,-1; 3 0,1.1
0603-RES = smd 1.1 x 1: 1 -0.85,0; 2 0.85,0
2X3 = drill 1.016 pad 1.88 octagon: 1 0,0; 2 0,2.54; 3 2.54,0; 4 2.54,2.54; 5 5.08,0; 6 5.08,2.54
FIDUCIAL_1MM = smd 1 x 1: 1 0,0
POT-TRIM-TT-43 = smd 1 x 1.8: 1 -1.4,-1.2; 3 1.4,-1.2 | smd 1.3 x 1.5: 2 0,1.22
CARDEDGE_12POS_MALE = smd 1.524 x 6.35: 1 6.35,0.635; 3 3.81,0.635; 5 1.27,0.635; 7 -1.27,0.635; 9 -3.81,0.635; 11 -6.35,0.635 | smd 1.524 x 6.35 bottom: 2 6.35,0.635; 4 3.81,0.635; 6 1.27,0.635; 8 -1.27,0.635; 10 -3.81,0.635; 12 -6.35,0.635
8-SMD = smd 1.3 x 1.4: 1 -3.96,-4.96; 2 -1.42,-4.96; 3 1.12,-4.96; 4 3.66,-4.96; 5 3.59,4.58; 6 1.05,4.58; 7 -1.49,4.58; 8 -4.03,4.58
2X8SMD = smd 1.524 x 5.08: P$1 -8.89,3.493; P$2 -6.35,3.493; P$3 -3.81,3.493; P$4 -1.27,3.493; P$5 1.27,3.493; P$6 3.81,3.493; P$7 6.35,3.493; P$8 8.89,3.493; P$9 -8.89,-3.493; P$10 -6.35,-3.493; P$11 -3.81,-3.493; P$12 -1.27,-3.493; P$13 1.27,-3.493; P$14 3.81,-3.493; P$15 6.35,-3.493; P$16 8.89,-3.493
CRYSTAL-SMD = smd 3 x 3: 1 -3.462,0; 2 3.39,0

### Placement (x,y rotation side)
C1  26.83,77.63 180 top
C2  85.09,44.61 270 top
C3  88,44.96 90 top
C4  37.94,77.63 0 top
C5  87.69,68.36 90 top
C6  15.4,37.31 180 top
C7  9.53,37.31 180 top
C8  80.44,68.46 90 top
C9  67.79,51.12 270 top
C10  29.69,35.4 0 top
C11  97.16,44.61 270 top
C12  127,51.59 270 top
C13  81.12,28.73 180 top
C18  103.98,57.15 270 top
C22  24.13,7.14 180 top
C23  27.62,7.14 180 top
C24  53.02,6.03 180 top
C25  56.67,20.48 180 top
C26  30.32,26.19 0 top
C27  28.73,20.48 180 top
C28  28.1,10.95 270 top
C29  34.45,3.49 180 top
C30  51.75,8.57 0 top
C31  51.75,23.65 0 top
C32  28.73,18.42 180 top
C33  18.41,17.62 180 top
C34  18.57,12.22 180 top
C36  9.53,7.94 0 top
CLK_LED  179.39,64.29 0 bottom
D1  107,48.26 90 top
D2  120.02,42.23 0 top
DUR  14.31,64.52 0 bottom
GLIDE  39.71,64.36 0 bottom
IC1  72.71,44.61 0 top
IC2  7.62,45.24 0 top
IC3  93.14,44.58 0 top
IC4  81.25,44.58 180 top
IC5  76.29,68.52 90 top
IC6  106.2,57.31 0 top
IC7  40.64,15.72 270 top
IC9  6.67,15.56 180 top
IC11  84.02,68.62 90 top
L1  24.13,4.92 0 top
MODE  103.37,64.2 0 bottom
MODE_LED  116.87,64.05 0 bottom
Q1  27.1,61.71 180 top
Q2  104.46,43.82 180 top
R1  109.86,48.26 270 top
R2  103.5,48.26 270 top
R3  83.98,71.12 0 top
R4  109.06,42.7 0 top
R5  76.36,71.12 0 top
R6  98.71,18.07 270 top
R7  102.5,18.07 270 top
R8  105.64,18.07 270 top
R9  37.78,28.42 90 top
R10  116.05,42.23 0 top
R11  87.79,40.01 0 top
R12  81.44,38.42 0 top
R13  27.62,4.92 180 top
R14  87.79,37.94 180 top
R15  121.13,59.53 90 top
R16  23.18,30.16 0 top
R17  18.26,31.43 0 top
R18  18.26,33.66 0 top
R19  31.43,29.85 0 top
R20  34.77,36.67 270 top
R21  37.31,36.67 270 top
R22  101.76,68.9 90 top
R23  107,61.59 90 top
R24  81.12,26.19 180 top
R27  14.92,15.56 270 top
R28  29.69,23.5 0 top
R29  16.83,28.73 90 top
R30  19.37,28.73 90 top
RANGE  136.23,64.52 0 bottom
RATE  161.63,64.52 0 bottom
SEQ_LED  9.21,30.96 0 bottom
SWD  21.27,23.65 0 top
TUNE  65.11,64.52 0 bottom
U$1  141.13,36.83 0 top
U$2  80.63,61.04 270 top
U$3  97.95,77.63 0 top
U$4  120.02,51.44 0 top
U$5  154.94,30.96 90 bottom
U$6  116.84,15.72 270 bottom
U$7  170.18,30.96 90 bottom
U$8  101.6,15.72 270 bottom
U$9  177.8,15.72 270 bottom
U$10  86.52,15.72 90 bottom
U$11  162.56,15.72 270 bottom
U$12  71.12,15.72 90 bottom
U$13  147.32,15.72 270 bottom
U$14  55.88,15.72 90 bottom
U$15  109.22,30.96 90 bottom
U$16  124.46,30.96 90 bottom
U$17  93.98,30.96 90 bottom
U$18  10.16,15.72 90 bottom
U$19  132.08,15.72 270 bottom
U$20  25.4,15.72 90 bottom
U$21  63.5,30.96 90 bottom
U$22  48.26,30.96 90 bottom
U$23  1.91,2.54 0 top
U$24  53.5,70.96 0 top
U$25  LOGOCG  [LOGO-CG]  177.96,78.11 0 top
U$33  31.18,46.89 180 top
Y1  23.15,15.03 270 top

### Tracks (layer width: path | path; a pad name or v marks a point on that pad's centre or on a via)
1N914
  Top 0.254: 105.73,46.99 106.88,46.99 D1.1 108.39,47.11 108.58,47.31 109.75,47.31 R1.2 | 105.73,46.99 105.31,47.41 R2.2 | Q2.1 105.41,46.67 105.73,46.99
1V/OCT_J  (via drill 0.6)
  Top 0.254: IC3.7 IC3.6 93.77,53.29 v94.3,53.82 | v94.93,66.83 94.93,72.87 94.14,73.66 | 94.14,78.58 93.98,78.74 93.98,79.38 U$3.9
  Top 0.61: 94.14,73.66 94.14,78.58
  Bottom 0.254: v94.3,53.82 94.3,66.2 v94.93,66.83
+3.3V  (via drill 0.6)
  Top 0.254: C27.1 C32.1 30.48,18.57 31.12,19.22 IC7.6 34.14,19.22 34.64,19.72 IC7.100 34.64,24.42 34.13,24.92 30.64,24.92 | 35.72,12.7 35.7,12.72 IC7.19 30.02,12.72 29.05,11.75 28.15,11.75 C28.1 | 35.72,12.7 35.64,12.62 IC7.28 35.64,4.68 35.3,4.34 | 41.59,12.7 45.24,12.7 46.64,11.3 IC7.50 48.29,7.97 48.89,8.57 | 41.59,12.7 35.72,12.7 | IC7.11 34.97,16.72 35.24,16.99 40.8,16.99 41.59,16.19 41.59,12.7 | v43.5,19.69 44.77,19.69 46.8,21.72 IC7.75 49.66,21.72 50.8,22.86 50.8,23.71 C31.1 | IC9.2 7.3,19.69 8.73,21.11 8.73,23.5 | 8.73,23.5 v8.73,24.77 | 8.67,23.55 8.73,23.5 | C36.1 8.67,9.47 v9.21,10 | 30.64,24.92 29.69,24.92 29.37,25.24 29.37,26.19 C26.1 | 29.53,26.19 C26.1 | C26.1 28.1,26.19 | R28.2 30.54,24.82 30.64,24.92 | R29.2 R30.2 20.74,29.58 21.53,28.79 25.34,28.79 26.35,27.78 | R4.2 111.6,42.7 113.66,40.64 121.44,40.64 129.38,48.58 129.38,51.44 128.43,52.39 127.06,52.39 C12.1
  Top 0.305: v35.4,1.91 35.4,3.23 arc90 C29.1 35.3,4.34 | L1.1 arc-90 23.34,5.34 23.34,3.49 v22.07,1.91 | 28.1,26.19 SWD.6 | C30.1 48.89,8.57 | 62.65,52.61 v63.18,52.07 | 132.57,57.01 129.2,60.38 127,60.38 | 127,60.38 R15.2 116.9,60.38 115.89,59.37 115.89,56.11 U$4.8 | C12.1 127,60.38
  Top 0.406: 10.32,37.36 C7.1 | 26.35,27.78 SWD.6
  Top 0.61: IC2.2 7.62,40.32 8.73,39.21 9.52,39.21 10.32,38.42 10.32,37.36 | C7.1 v12.06,37.31 C6.A | TUNE.3 62.65,52.61 | 132.57,57.01 RANGE.3
  Bottom 0.254: v43.5,19.69 43.5,21.27 42.54,22.23 34.92,22.23 30.96,26.19 26.51,26.19 25.88,26.83 | v9.21,10 7.46,10 7.3,10.16 | v8.73,24.77 7.62,24.77
  Bottom 0.305: 6.98,29.13 SEQ_LED.5 | 6.98,32.78 SEQ_LED.1 | v22.07,1.91 22.07,0.64 | SWD.6 26.35,26.35 25.88,26.83 24.92,27.78 22.7,27.78 22.22,28.26 | 11.85,54.51 12.54,53.82 14.29,53.82 18.89,49.21 18.89,40.48 | 36.02,56.85 35.24,57.63 35.24,61.28 | 61.12,58.53 61.12,60.17 60.01,61.28 43.18,61.28 42.39,62.07 36.04,62.07 35.24,61.28 | 35.24,61.28 18.57,61.28 17.3,62.55 11.43,62.55 9.84,60.96 9.84,57.79 10.64,56.99 10.65,57.01 | v63.18,52.07 63.34,51.91 108.27,51.91 114.62,58.26 114.62,62.2 MODE_LED.5 MODE_LED.3 MODE_LED.1 114.62,65.91 114.62,66.99 116.05,68.42 121.13,68.42 123.67,65.88 123.67,58.74 125.4,57.01 | RANGE.3 133.83,56.95 | 133.83,54.61 134.62,53.82 143.67,53.82 147,57.15 | 159.02,57.15 RATE.3 | 159.17,54.35 160.02,53.5 170.02,53.5 177.32,60.8 177.32,62.36 CLK_LED.5 CLK_LED.3 CLK_LED.1
  Bottom 0.406: 6.98,29.13 6.98,28.1 7.62,27.46 7.62,24.77 7.62,21.59 4.44,18.42 4.44,13.02 7.3,10.16 7.3,7.46 4.76,4.92 4.6,4.92 4.6,1.91 5.87,0.64 22.07,0.64 35.4,0.64 v35.4,1.91 | SEQ_LED.5 SEQ_LED.3 SEQ_LED.1 | 6.98,32.78 6.98,33.81 7.62,34.45 11.91,34.45 21.56,34.45 22.25,33.95 22.25,28.26 22.22,28.26 | v12.06,37.31 11.91,37.15
  Bottom 0.61: 11.91,34.45 11.91,37.15 15.56,37.15 18.89,40.48 | 11.85,54.51 DUR.3 10.65,57.01 | GLIDE.3 36.02,56.85 | 61.12,58.53 TUNE.3 | RANGE.3 125.4,57.01 | 133.83,56.95 133.83,54.61 | 147,57.15 159.02,57.15 | RATE.3 159.17,54.35
+5V  (via drill 0.6)
  Top 0.254: IC4.1 83.15,50.2 81.12,52.23 76.2,52.23 71.99,56.44 | IC6.5 105.09,58.26 104.77,57.94 104.04,57.94 | 104.04,57.94 C18.1 103.98,59.69 101.76,61.91 R22.1 | R12.2 v83.98,38.42 | 104.04,57.94 101.92,57.94 100.33,59.53 91.44,59.53 90.65,60.33 90.65,64.29 91.12,64.77 92.71,64.77 93.82,65.88 93.82,67.31 94.14,67.63 94.14,68.58 91.6,71.12 91.6,72.55 | C9.1 67.89,52.07 68.9,52.07
  Top 0.305: IC1.14 68.9,52.07 68.9,53.34 71.99,56.44 73.82,58.26 73.82,66.2 | 73.82,66.2 73.82,72.55 | C2.1 v85.09,46.99 | v85.09,46.99 83.35,46.99 IC4.1 | C3.A 86.67,46.36 86.04,46.99 v85.09,46.99 | IC5.5 75.25,67.87 75.25,66.2 | 75.25,66.2 73.82,66.2 | C8.1 80.49,68.2 80.49,65.96 | 75.25,66.2 76.36,66.2 76.52,66.04 76.68,65.96 80.49,65.96 | C5.1 87.63,68.09 87.63,66.52 87.07,65.96 83.07,65.96 | IC11.5 83.07,65.96 | 83.07,65.96 80.49,65.96
  Top 0.61: IC2.3 v13.73,42.15 | v8.89,52.86 5.71,56.04 5.71,69.69 7.73,71.71 Q1.3 24.43,70.93 C1.+ 24.43,79.52 25.24,80.33 66.04,80.33 73.82,72.55 91.6,72.55 U$3.11
  Bottom 0.254: v83.98,38.42 85.09,39.53 v85.09,46.99
  Bottom 0.61: v8.89,52.86 13.18,52.86 14.13,51.91 14.13,42.54 v13.73,42.15
+12V  (via drill 0.6)
  Top 0.254: C11.1 91.54,45.46 91.28,45.72 91.28,47.13 IC3.8 91.23,53.34
  Top 0.406: 93.03,66.68 91.92,65.56 90.8,65.56 89.85,64.61 89.85,58.1 91.23,56.72 91.23,53.34 91.07,53.18 v89.85,53.18 | v32.54,54.45 32.54,50.48 U$33.P$12
  Top 0.61: 93.03,66.68 v93.03,67.95 | U$33.P$12 U$33.P$4 32.45,40.55 32.07,40.16 32.07,35.42 C10.+
  Bottom 0.406: v89.85,53.18 35.88,53.18 34.36,54.68 32.77,54.68 v32.54,54.45
  Bottom 0.61: v93.03,67.95 93.03,72.39 94.14,73.5 U$3.10
-12V
  Top 0.61: U$33.P$16 U$33.P$8
CLK_LED_1
  Top 0.254: IC7.34 38.64,4.86 40.16,3.33 82.39,3.33 87.15,8.1 87.15,9.68 94.69,17.22 R6.2
CLK_LED_2
  Top 0.254: IC7.33 38.14,4.09 39.53,2.7 82.71,2.7 87.79,7.78 87.79,9.37 93.82,15.4 101.76,15.4 102.5,16.14 R7.2
CLK_LED_3
  Top 0.254: IC7.32 37.64,3.32 38.89,2.06 83.03,2.06 88.42,7.46 88.42,9.05 94.14,14.76 104.93,14.76 105.64,15.48 R8.2
CLKIN  (via drill 0.6)
  Top 0.254: IC7.31 37.14,2.87 38.58,1.43 86.84,1.43 89.69,4.29 89.69,7.46 94.61,12.38 v94.61,13.02 | v86.04,23.02 86.04,33.5 88.9,36.35 95.57,36.35 101.92,42.7 104.45,42.7 Q2.3 104.63,42.55 106.68,42.55 106.84,42.7 R4.1
  Bottom 0.254: v94.61,13.02 94.61,20.48 92.07,23.02 v86.04,23.02
CLKIN_J  (via drill 0.6)
  Top 0.254: R1.1 109.85,56.36 v108.9,57.31 | v98.11,69.22 98.11,73.03 99.22,74.14
  Top 0.61: 99.22,74.14 U$3.5
  Bottom 0.254: v108.9,57.31 101.44,57.31 99.22,59.53 97.15,59.53 96.68,60.01 96.68,61.28 98.11,62.71 v98.11,69.22
DAC_CS  (via drill 0.6)
  Top 0.254: IC7.77 46.14,26.46 49.85,30.16 60.32,30.16 62.71,32.54 67.94,32.54 v69.85,34.45 | v69.85,37.94 70.17,38.26 IC1.2
  Bottom 0.254: v69.85,34.45 v69.85,37.94
DAC_MOSI  (via drill 0.6)
  Top 0.254: IC7.80 44.64,27.5 48.74,31.59 57.94,31.59 58.58,32.23 arc1 v64.93,38.74 | v75.25,45.24 IC1.9
  Bottom 0.254: v64.93,38.74 68.74,38.74 v75.25,45.24
DAC_OUT
  Top 0.254: IC4.8 83.18,41.95 83.18,40.64 85.88,37.94 R14.2
DAC_SCK
  Top 0.254: IC7.78 45.64,27.07 49.53,30.96 59.21,30.96 64.93,36.67 71.28,36.67 73.98,39.37 IC1.5
DUR  (via drill 0.6)
  Top 0.254: IC7.15 36.78,14.72 v37.62,15.56
  Bottom 0.254: v37.62,15.56 45.88,15.56 46.2,15.88 46.2,17.78 53.82,25.4 53.82,34.77 51.59,36.99 45.08,36.99 37.46,29.21 28.1,29.21 26.35,30.96 26.35,39.69 20,46.04 20,49.21 14.35,54.87
  Bottom 0.61: DUR.WIPER 14.35,54.87
GATE  (via drill 0.6)
  Top 0.254: IC7.85 42.14,27.23 40.8,28.58 40.8,34.13 54.61,47.94 v54.61,62.55 | v78.74,66.99 79.22,67.47 79.22,67.63 78.32,68.52 IC5.2
  Bottom 0.254: v54.61,62.55 57.31,62.55 57.78,63.02 57.78,66.99 60.01,69.22 74.93,69.06 76.99,66.99 v78.74,66.99
GATE_J  (via drill 0.6)
  Top 0.254: 96.68,65.72 94.77,63.82 v91.76,63.82 | v78.74,71.28 78.58,71.12 R5.2
  Top 0.61: U$3.7 96.68,65.72
  Bottom 0.254: v91.76,63.82 89.06,66.52 89.06,71.12 88.11,72.07 79.53,72.07 v78.74,71.28
GLIDE  (via drill 0.6)
  Top 0.254: IC7.16 38.5,14.22 v38.89,14.61 | GLIDE.WIPER 39.85,56.75 | 39.85,54.93 43.81,50.96 v43.81,39.05
  Top 0.61: 39.85,56.75 39.85,54.93
  Bottom 0.254: v38.89,14.61 46.35,14.61 46.83,15.08 46.83,17.46 54.77,25.4 54.77,35.72 52.07,38.42 44.61,38.26 v43.81,39.05
GND  (via drill 0.6)
  Top 0.254: 53.66,23.76 53.66,22.54 52.33,21.22 IC7.74 47.09,21.22 44.13,18.26 35.3,18.26 35.14,18.42 | 53.66,23.76 53.66,23.97 | 28.26,17.3 28.34,17.22 IC7.10 34.52,17.22 35.14,17.84 35.14,18.42 | IC7.27 35.14,5.61 33.65,4.13 | IC7.20 30.26,12.22 29.31,11.26 29.31,10 | 29.31,8.99 29.31,10 | C22.2 23.34,7.84 23.34,8.26 | C23.2 26.67,7.88 26.67,8.26 | C26.2 34.13,26.19 35.14,25.19 IC7.99 35.14,18.47 35.08,18.42 35.14,18.42 | C31.2 52.66,23.76 53.66,23.76 | 9.21,34.93 9.37,34.93 | IC9.4 IC9.3 | C28.2 29.21,10.1 29.31,10 | IC9.3 6.03,19.53 7.62,21.11 | R27.1 14.98,16.35 16.14,16.35 | 10.39,17.69 9.84,17.15 9.84,16.35 9.37,15.88 6.03,15.88 | 6.03,15.88 IC9.3 | 6.03,15.88 2.06,15.88 | C36.2 12.22,7.94 13.41,6.75 | Q2.2 103.46,44.77 101.92,44.77 101.6,45.09 101.6,48.9 101.92,49.21 103.4,49.21 R2.1 103.61,49.21 105.09,49.21 105.29,49.41 D1.2 v107,53.82 106.85,53.96 106.85,55.25 | IC5.1 76.59,67.87 76.36,68.1 76.36,69.06 76.48,69.17 IC5.3 80.31,69.17 arc90 C8.2 81.66,69.31 82.39,68.58 84.14,68.58 | 84.14,68.58 84.14,69.06 84.3,69.22 84.91,69.22 IC11.3 87.62,69.27 arc-90 C5.2 | 84.14,68.58 84.14,68.1 84.27,67.97 IC11.1 | 123.51,55.92 123.51,57.15 v125.41,59.06 | C18.2 105.49,56.3 IC6.1 105.55,57.14 105.73,57.31 106.68,57.31 106.84,57.15 106.84,56.37 IC6.3 | IC1.1 67.68,41.54 66.67,42.55 66.67,44.45 | C9.2 67.52,50.01 66.52,50.01 | C13.2 80.27,36.09 79.22,37.15 79.22,41.86 IC4.5
  Top 0.305: 28.26,17.3 27.88,17.68 C32.2 C27.2 21.27,20.48 20.8,20 13.91,20 | 29.31,8.99 28.57,8.26 26.67,8.26 23.34,8.26 20.8,8.26 19.84,9.21 18.41,9.21 | 12.22,2.38 12.35,2.38 | 36.67,29.27 35.34,29.27 34.13,30.48 34.13,31.43 | C34.2 16.67,12.22 16.14,12.8 | C33.2 17.46,17.72 16.35,17.72 | C30.2 56.2,8.57 v57.63,7.14 56.51,6.03 C24.C | C25.C 58.07,21.94 57.94,22.07 | 57.94,22.07 57.47,22.54 53.66,22.54 | 53.66,23.97 53.66,24.77 53.02,25.4 v51.59,25.4 | 87.62,69.27 88.35,70.01 v90.01,70.01 | C12.2 126.1,50.74 125.73,51.12 125.73,55.4 125.09,56.04 123.63,56.04 U$4.5 123.51,55.92 | IC1.10 73.98,45.4 73.34,44.77 72.55,44.77 | 72.55,44.77 66.52,44.77 | 66.52,44.77 66.52,50.01 66.52,53.64 67.65,54.77 | 66.52,44.77 66.52,44.61 66.67,44.45 | IC1.4 72.71,43.66 | 72.71,43.66 72.71,44.61 72.55,44.77 | v58.58,23.81 58.58,22.7 57.94,22.07 | 72.71,43.66 72.87,43.82 76.04,43.82 76.52,43.34 IC1.7 78.21,41.54 78.58,41.91 79.27,41.91 IC4.5 79.34,43.47 79.85,43.97 81.44,43.97 81.76,43.82 | 81.76,43.82 81.88,43.37 IC4.7 | 81.76,43.82 85.03,43.82 C2.2 85.28,43.56 C3.C 87.79,43.35 87.79,41.91 86.94,41.06 R11.1 | IC3.4 95.28,42.23 96.52,42.23 97.15,42.86 C11.2 97.37,43.97 100.96,43.97 101.76,44.77 101.92,44.77 | IC6.1 105.57,56.34 | 106.85,55.25 IC6.3
  Top 0.406: 8.73,37.05 C7.2 | 105.57,0.64 33.5,0.64 | 33.5,0.64 13.97,0.64 12.22,2.38 12.22,5.56 12.38,5.72 | 16.42,45.33 16.35,45.24 | 15.02,34.93 9.21,34.93 8.73,35.4 8.73,37.05 | 8.73,37.05 8.73,37.31 | R9.2 36.67,29.27 | 18.41,9.21 15.87,9.21 13.41,6.75 12.38,5.72 | 33.65,2.44 C29.2 | 33.65,2.44 33.65,1.11 33.5,0.64 | 33.65,2.44 33.65,4.13 | 15.02,34.93 15.02,25.24 15.24,25.24 | 15.24,25.24 13.81,23.81 13.81,20.11 13.91,20 16.14,17.78 | 16.14,17.78 16.14,16.35 16.14,12.8 | 16.35,17.72 16.14,17.78 | SWD.1 20.32,23.65 18.73,25.24 15.24,25.24 | 16.83,37.34 17.17,37.34 | 12.38,5.72 v10.95,5.72 2.7,5.72 2.06,6.35 2.06,15.88 2.06,40.96 3.33,42.23 5.31,42.23 IC2.1 5.31,41.91 5.24,41.91 | 15.02,34.93 24.76,34.93 24.76,33.66 26.03,32.39 33.18,32.39 34.13,31.43
  Top 0.61: IC2.1 5.31,44.52 6.03,45.24 16.35,45.24 | 5.24,41.91 5.24,39.21 7.4,37.05 8.73,37.05 | C6.C 16.83,37.34 16.83,44.93 16.42,45.33 | C1.- 29.23,71.13 Q1.1 29.96,71.12 | GLIDE.1 47.64,56.85 49.21,58.42 49.21,78.58 46.83,79.06 29.37,79.06 29.23,78.92 C1.- | 67.65,54.77 TUNE.1 | U$33.P$5 U$33.P$6 U$33.P$7 24.83,35.4 | 24.83,35.4 24.83,35 24.76,34.93 | 17.17,37.34 17.17,35.11 17.14,35.08 | DUR.1 16.85,54.75 17.62,53.98 24.13,53.98 24.83,53.27 U$33.P$15 U$33.P$14 U$33.P$13 | C10.- 24.83,35.4 | C4.- C1.-
  Bottom 0.254: 59.99,10.32 60.01,10.8 | 133.51,29.69 133.51,24.77 133.83,24.77 | MODE.1 106.69,66.36 111.28,66.36 | v125.41,59.06 125.41,70.64 | v107,53.82 107.79,53.82 108.19,53.42
  Bottom 0.305: v57.63,7.14 58.74,7.14 60.01,8.41 60.01,10.31 59.99,10.32 | U$22.1 50.46,26.53 v51.59,25.4 | 96.18,24.9 96.2,24.77 | 96.2,24.77 66.36,24.77 65.7,25.42 U$21.1 65.7,25.54 65.09,24.92 59.69,24.92 v58.58,23.81 | 99.54,24.77 110.65,24.77 110.81,24.77 111.42,25.38 U$15.1 | 99.54,24.77 96.2,24.77 | U$17.1 96.2,27.45 96.2,24.77 | U$8.1 99.54,19.34 99.54,24.77 | U$6.1 114.64,24.77 114.3,24.77 | U$19.1 129.88,24.77 129.7,24.77 | U$16.1 126.66,24.77 | U$13.1 145.12,24.77 145.26,24.77 | 157.14,24.77 157.48,24.77 | 157.14,24.79 U$5.1 | 172.38,25.58 U$7.1 | U$11.1 160.36,24.77 | U$9.1 175.6,21.86 172.14,25.32 | v90.01,70.01 91.6,70.01
  Bottom 0.406: 12.38,10.32 27.62,10.32 | 27.62,10.32 58.1,10.32 | 58.1,10.32 60.01,10.8 73.5,10.8 | U$18.1 12.38,12.21 12.38,10.32 | 12.38,10.32 10.95,8.89 v10.95,5.72 | U$20.1 27.62,12.21 27.62,10.32 | 157.16,24.77 157.48,24.77 160.36,24.77 171.61,24.77 172.14,25.32 172.38,25.58 | 157.16,24.77 145.26,24.77 133.83,24.77 129.7,24.77 126.66,24.77 114.3,24.77 110.65,24.77 | 157.14,24.79 157.16,24.77 | U$14.1 58.1,12.23 58.1,10.32 | U$12.1 73.5,12.23 73.5,10.8 | U$10.1 88.74,12.21 88.74,10.64 88.26,10.16 85.09,10.16 84.45,10.8 77.31,10.8 | 73.5,10.8 77.31,10.8 | 77.31,10.8 77.31,24.61 | 16.85,54.75 17.62,53.98 24.76,53.98 27.94,57.15 33.5,57.15 36.67,53.98 42.54,53.98 | 42.54,53.98 67.31,53.98 | 67.31,53.98 71.75,53.98 72.87,55.09 93.03,55.09 93.03,52.71 107.47,52.71 108.19,53.42 111.28,56.52 111.28,66.36 115.57,70.64 125.41,70.64 147.48,70.64 | 147.48,70.64 169.07,70.64 171.77,67.95 171.77,59.06 169.72,57.01 | RANGE.1 138.94,56.83 | 144.62,56.83 147.48,59.69 147.48,70.64 | 67.65,54.15 arc-90 67.31,53.98 | 42.25,54.11 arc90 42.54,53.98
  Bottom 0.61: DUR.1 16.85,54.75 | 169.72,57.01 RATE.1 | 138.94,56.83 144.62,56.83 | TUNE.1 67.65,54.15 | GLIDE.1 42.25,54.11 | 93.03,55.09 93.03,65.72 91.6,67.15 91.6,70.01 U$3.12
  other vias: 101.12,28.26 33.5,1.91 99.54,26.04 86.84,3.49 111.6,37.31 41.59,19.21
  pour Bottom (isolate 0.305): 0.16,81.12 78.26,81.12 78.26,72.87 117.63,72.87 117.63,81.12 184.94,81.12 184.94,0.48 0.16,0.48
  pour Top (isolate 0.305): 0.16,81.12 78.26,81.12 78.26,72.87 117.63,72.87 117.63,81.12 184.94,81.12 184.94,0.48 0.16,0.48
K1  (via drill 0.6)
  Top 0.254: IC7.51 57.43,9.72 61.44,5.72 v69.69,5.72
  Bottom 0.254: v69.69,5.72 75.56,5.72 76.2,5.08 87.31,5.08 91.44,0.95 177.8,0.95 181.41,4.56 181.41,9.8 184.47,12.86 184.47,30.8 174.47,40.8 154.15,40.8 152.4,39.05 152.4,34.18 U$5.2
K2  (via drill 0.6)
  Top 0.254: IC7.52 57.73,10.22 61.28,6.67 v70.8,6.67
  Bottom 0.254: v70.8,6.67 75.56,6.67 76.68,5.56 87.79,5.56 91.76,1.59 177.32,1.59 180.82,5.08 180.82,10.16 183.83,13.18 183.83,30.48 174.15,40.16 169.39,40.16 167.64,38.42 167.64,34.18 U$7.2
K3  (via drill 0.6)
  Top 0.254: IC7.53 58.02,10.72 61.12,7.62 v72.07,7.62
  Bottom 0.254: v72.07,7.62 75.41,7.62 76.99,6.03 89.06,6.03 92.39,9.37 95.88,9.37 97,8.26 103.5,8.26 106.2,5.56 164.78,5.56 168.43,9.21 178.12,9.21 179.07,10.16 179.7,10.16 180.34,10.8 180.34,12.49 U$9.2
K4  (via drill 0.6)
  Top 0.254: IC7.54 58.32,11.22 60.96,8.57 v73.18,8.57
  Bottom 0.254: v73.18,8.57 75.25,8.57 77.31,6.51 88.74,6.51 92.07,9.84 96.2,9.84 97.31,8.73 103.82,8.73 106.52,6.03 162.56,6.03 165.1,8.57 165.1,12.49 U$11.2
K5  (via drill 0.6)
  Top 0.254: IC7.55 58.61,11.72 60.8,9.53 v74.29,9.53
  Bottom 0.254: v74.29,9.53 75.09,9.53 77.63,6.99 88.42,6.99 91.76,10.32 96.52,10.32 97.63,9.21 104.14,9.21 106.84,6.51 146.68,6.51 149.86,9.68 149.86,12.49 U$13.2
K6  (via drill 0.6)
  Top 0.254: IC7.63 60.32,15.72 61.75,17.15 84.14,17.15 99.22,32.23 99.85,32.23 v105.89,38.26
  Bottom 0.254: v105.89,38.26 106.72,37.43 U$15.2
K7  (via drill 0.6)
  Top 0.254: IC7.65 60.53,16.72 61.44,17.62 83.18,17.62 88.26,22.7 v88.26,26.04
  Bottom 0.254: v88.26,26.04 88.26,33.34 89.07,34.14 U$17.2
K8  (via drill 0.6)
  Top 0.254: IC7.56 78.11,12.22 v81.12,9.21
  Bottom 0.254: v81.12,9.21 82.87,7.46 88.11,7.46 91.44,10.8 96.84,10.8 97.95,9.68 106.2,9.68 106.52,10 122.4,10 123.19,10.8 129.38,10.8 129.86,10.32 134.3,10.32 134.62,10.64 134.62,12.49 U$19.2
K9  (via drill 0.6)
  Top 0.254: IC7.57 79.2,12.72 v82.71,9.21
  Bottom 0.254: v82.71,9.21 83.98,7.94 87.79,7.94 91.12,11.27 97.15,11.27 98.27,10.16 105.89,10.16 106.2,10.48 119.06,10.48 119.38,10.8 119.38,12.49 U$6.2
K10  (via drill 0.6)
  Top 0.254: IC7.58 80.29,13.22 v84.3,9.21
  Bottom 0.254: v84.3,9.21 88.26,9.21 90.8,11.75 97.47,11.75 98.58,10.64 103.66,10.64 104.14,11.11 104.14,12.49 U$8.2
K11  (via drill 0.6)
  Top 0.254: IC7.59 78.17,13.72 v78.9,14.45
  Bottom 0.254: v78.9,14.45 80.64,16.19 80.64,17.94 81.6,18.89 U$10.2
K12  (via drill 0.6)
  Top 0.254: IC7.60 63.9,14.22 v64.61,14.92
  Bottom 0.254: v64.61,14.92 64.61,17.46 66.04,18.89 68.61,18.89 U$12.2
K13  (via drill 0.6)  (1 unrouted)
  Top 0.254: IC7.61 62.18,14.72 v62.86,15.4
  Bottom 0.254: v62.86,15.4 62.86,19.53 61.12,21.27 53.97,21.27 53.34,20.64 53.34,19.05
K14  (via drill 0.6)
  Top 0.254: IC7.62 60.62,15.22 62.07,16.67 84.45,16.67 99.22,31.43 100.65,31.43 108.27,39.05 119.22,39.05 120.02,39.04 v121.28,39.04
  Bottom 0.254: v121.28,39.04 121.96,38.37 U$16.2
K15  (via drill 0.6)
  Top 0.254: IC7.1 30.99,21.72 30.48,22.23 27.15,22.23 26.83,21.91 20.95,21.91 18.57,24.29 16.83,24.29 v15.08,22.54
  Bottom 0.254: v15.08,22.54 14.92,22.54 13.81,21.43 8.57,21.43 7.66,20.52 U$18.2
K16  (via drill 0.6)
  Top 0.254: IC7.2 30.69,21.22 30.32,21.59 27.3,21.59 26.99,21.27 v19.68,21.27
  Bottom 0.254: v19.68,21.27 19.68,19.69 20.48,18.89 20.49,18.9 U$20.2
K17  (via drill 0.6)
  Top 0.254: v56.99,32.7 47.47,32.7 44.14,29.38 IC7.81
  Bottom 0.254: U$21.2 60.8,34.13 58.58,34.13 57.15,32.7 v56.99,32.7
K18  (via drill 0.6)
  Top 0.254: IC7.82 43.64,28.12 42.86,28.89 v42.86,32.54
  Bottom 0.254: U$22.2 45.75,34.13 44.45,34.13 v42.86,32.54
MIDI_RXD  (via drill 0.6)
  Top 0.254: IC7.93 38.14,25.92 38.89,26.67 38.89,29.85 38.26,30.48 36.51,30.48 v35.24,31.75 | v121.13,52.86 121.13,55.95 U$4.6
  Top 0.305: R15.1 121.06,58.62 U$4.6
  Bottom 0.254: v35.24,31.75 35.24,37.15 39.21,41.12 47.15,41.12 55.09,49.05 117.32,49.05 v121.13,52.86
MIDI_TXD  (via drill 0.6)
  Top 0.254: IC7.92 38.64,25.46 39.37,26.19 39.37,30.8 37.94,32.23 v36.67,32.23 | v100.49,47.47 100.49,53.66 101.44,54.61 105.57,54.61 106.2,55.25 IC6.2
  Bottom 0.254: v36.67,32.23 36.67,37.31 39.69,40.32 47.31,40.32 55.4,48.42 100.17,48.42 100.49,48.1 v100.49,47.47
MIDIIN_4  (via drill 0.6)
  Top 0.254: v108.74,67.47 108.74,61.91 111.76,58.9 111.76,44.29 113.82,42.23 R10.1
  Bottom 0.254: 104.3,71.91 v108.74,67.47
  Bottom 0.61: U$3.2 104.3,71.91
MIDIIN_5
  Top 0.254: D2.2 121.13,42.26 U$4.3 121.13,48.26 119.38,50.01 115.73,50.01 113.66,52.07 113.66,64.14 104.3,73.5
  Top 0.61: U$3.1 104.3,73.5
MIDIOUT_4  (via drill 0.6)
  Top 0.254: R22.2 v101.76,71.44
  Bottom 0.61: v101.76,71.44 U$3.4
MIDIOUT_5
  Top 0.254: U$3.3 101.92,79.38 | 101.92,73.03 107,67.95 R23.2
  Top 0.61: 101.92,79.38 101.92,73.03
MODE  (via drill 0.6)
  Top 0.254: IC7.83 43.14,27.82 41.75,29.21 41.75,33.18 58.42,49.85 58.42,57.94 60.8,60.33 v71.6,60.33 | v91.76,60.64 v97.79,60.64
  Bottom 0.254: v71.6,60.33 73.66,60.33 78.42,65.09 87.31,65.09 v91.76,60.64 | v97.79,60.64 99.22,60.73 MODE.2
MODE_LED_1
  Top 0.254: IC7.95 37.14,26.36 33.71,29.79 R19.2
MODE_LED_2
  Top 0.254: R20.2 34.77,34.93 35.88,33.81 37.31,33.81 39.85,31.27 39.85,25.88 39.14,25.17 IC7.91
MODE_LED_3
  Top 0.254: IC7.90 39.64,24.88 40.32,25.56 40.32,31.59 37.31,34.61 R21.2
MRST  (via drill 0.6)
  Top 0.254: IC9.1 8.57,19.69 10.64,21.75 v10.64,22.7
  Bottom 0.254: v10.64,22.7 10.64,25.4 12.06,26.83 16.99,26.83 17.62,26.19 SWD.2
N$1  (via drill 0.6)
  Top 0.254: R19.1 29.37,29.85 v28.1,31.12
  Bottom 0.254: v28.1,31.12 28.1,41.12 30.32,43.34 45.88,43.34 53.5,50.96 109.38,50.96 119.06,60.64 119.06,62.24 MODE_LED.6
N$2  (via drill 0.6)
  Top 0.254: R20.1 34.61,37.62 33.81,38.42 v33.81,39.21
  Bottom 0.254: v33.81,39.21 36.99,42.39 46.2,42.39 54.13,50.32 110.65,50.32 121.28,60.96 121.28,63.66 120.89,64.05 MODE_LED.4
N$3
  Top 0.254: IC7.13 27.94,15.72 24.92,12.7 24.02,12.7 Y1.2
  Top 0.305: C34.1 21.59,12.22 21.84,12.14 Y1.2
N$4  (via drill 0.6)
  Top 0.254: v35.4,39.21 36.83,39.21 37.31,38.74 R21.1
  Bottom 0.254: v35.4,39.21 37.94,41.75 46.83,41.75 54.77,49.69 111.28,49.69 122.4,60.8 122.4,65.25 121.76,65.88 119.1,65.88 MODE_LED.2
N$5
  Top 0.254: IC7.49 46.14,6.88 46.83,6.19
  Top 0.406: 46.83,6.19 51.12,6.19 C24.A
N$6
  Top 0.254: IC7.12 27.6,16.22 25.35,18.47 Y1.1
  Top 0.305: C33.1 21.91,17.62 21.96,17.99 Y1.1
N$7
  Top 0.254: 85.96,61.04 88.58,58.42 88.58,49.69 90.33,47.94 90.33,45.24 90.8,44.77 91.92,44.77 92.55,44.13 92.5,44.08 IC3.2 92.5,40.43 92.07,40.01 R11.2
  Top 0.305: 85.96,61.04 U$2.2
N$8
  Top 0.254: R14.1 92.55,37.94 93.82,39.21 93.82,41.98 IC3.3
N$9
  Top 0.61: Q1.4 32.88,60.62 34.37,59.13 | 34.37,59.13 34.99,58.51 U$33.P$11 U$33.P$3 | C4.+ 40.34,65.11 34.37,59.13
N$10
  Top 0.254: IC11.4 83.03,69.95 83.03,70.64 83.13,70.75 R3.1
N$11  (via drill 0.6)
  Top 0.254: R6.1 98.71,20.92 101.12,23.34 118.59,23.34 140.81,45.56 140.81,47.47 145.26,51.91 v146.84,51.91
  Bottom 0.254: v146.84,51.91 172.72,51.91 181.61,60.8 181.61,62.47 CLK_LED.6
N$12
  Top 0.254: IC5.4 75.34,70.58 75.51,70.75 R5.1
N$13
  Top 0.254: R24.2 78.58,26.19 70.8,18.42 60.8,18.42 60.1,17.72 IC7.67
N$14  (via drill 0.6)
  Top 0.254: R7.1 102.5,20.9 104.3,22.7 118.9,22.7 141.76,45.56 141.76,46.83 143.99,49.05 v146.21,49.05
  Bottom 0.254: v146.21,49.05 171.29,49.05 183.67,61.44 183.67,63.66 183.04,64.29 CLK_LED.4
N$15  (via drill 0.6)
  Top 0.254: R8.1 105.64,20.56 107.16,22.07 119.22,22.07 v143.99,46.83
  Bottom 0.254: v143.99,46.83 170.66,46.83 184.47,60.64 184.47,64.77 183.14,66.09 CLK_LED.2
N$17
  Top 0.254: IC7.73 52.31,20.72 52.55,20.48
  Top 0.305: 52.55,20.48 C25.A
N$18
  Top 0.254: IC4.6 80.61,39.97 80.49,39.85 80.49,38.84 R12.1
N$19  (via drill 0.6)
  Top 0.254: R18.1 16.51,33.66 v16.03,33.18
  Bottom 0.254: v16.03,33.18 13.33,33.18 13.02,32.86 11.51,32.86 SEQ_LED.2
N$20  (via drill 0.6)
  Top 0.254: R17.1 16.67,31.43 v16.03,30.8
  Bottom 0.254: v16.03,30.8 13.18,30.8 13.02,30.96 SEQ_LED.4
N$21
  Top 0.254: IC7.94 37.64,26.53 37.78,26.67 R9.1
N$22  (via drill 0.6)
  Top 0.254: v20.48,30.64 21.11,30.64 21.59,30.16 R16.1
  Bottom 0.254: SEQ_LED.6 13.07,29.16 13.18,29.21 19.05,29.21 v20.48,30.64
N$24  (via drill 0.6)
  Top 0.254: v91.44,58.42 95.73,54.13 95.73,50.64 95.09,50.01 95.09,49.37 IC3.5 arc-90 95.16,47.31 | IC3.1 90.41,41.98 89.69,42.7 89.69,47.63 87.63,49.69 87.63,56.52 86.68,57.47
  Top 0.305: 86.68,57.47 77.79,57.47 76.68,58.58 76.68,61.44 77.68,62.44 U$2.1 85.04,62.44 v85.09,62.39
  Bottom 0.305: v91.44,58.42 87.47,62.39 v85.09,62.39
N$27  (via drill 0.6)
  Top 0.254: IC4.2 81.91,47.15 v81.91,45.24 | v71.44,43.82 IC1.3
  Bottom 0.254: v81.91,45.24 79.69,47.47 72.23,47.47 71.44,46.67 v71.44,43.82
N$28
  Top 0.254: 24.98,4.07 25.4,3.65 26.83,3.65 | 26.83,3.65 29.84,3.65 30.48,4.29 30.48,10.8 30.9,11.22 IC7.22 | R13.2 26.77,3.75 26.83,3.65 | C22.1 L1.2
  Top 0.305: L1.2 24.98,4.07
N$29
  Top 0.254: IC7.21 30.61,11.72 29.84,10.95 29.84,7.62 29.37,7.14 C23.1 28.47,6.72 | 28.47,6.41 R13.1
  Top 0.305: 28.47,6.72 28.47,6.41
N$30
  Top 0.254: U$4.2 118.59,44.12 118.86,43.85 D2.1 R10.2
N$34
  Top 0.254: IC6.4 106.84,58.27 106.84,59.37 107,59.53 R23.1
N$36  (via drill 0.6)
  Top 0.254: IC1.6 75.25,39.69 75.72,39.21 v76.68,39.21 | v78.26,44.45 78.9,45.09 80.01,45.09 80.61,45.69 IC4.3
  Bottom 0.254: v76.68,39.21 78.26,40.8 v78.26,44.45
N$37
  Top 0.254: IC1.8 76.73,47.47 78.26,47.47 78.55,47.18 IC4.4
NRST
  Top 0.254: IC7.14 28.39,15.22 26.35,13.18 26.35,10.48 25.4,9.53 21.27,9.53 20.48,10.32 15.4,10.32 14.92,10.8 14.92,11.75 | 14.87,14.76 R27.2 14.92,11.75 | 14.92,11.75 13.02,11.75 12.54,12.22 12.54,13.43 10.73,15.24 7.94,15.24 7.3,14.61 IC9.7
PWM_J  (via drill 0.6)
  Top 0.254: v97,54.61 98.11,53.5 v98.11,47.31 | v82.07,31.43 82.07,28.84 C13.1 R24.1
  Bottom 0.254: v98.11,47.31 98.11,41.75 93.82,37.47 88.11,37.47 v82.07,31.43
  Bottom 0.305: 96.68,63.02 95.41,61.75 95.41,56.2 v97,54.61
  Bottom 0.61: U$3.8 96.68,63.02
RANGE
  Top 0.254: IC7.36 39.64,5.76 40.8,4.6 81.76,4.6 85.88,8.73 85.88,10.32 100.81,25.24 117.63,25.24 123.03,30.64 123.03,41.12 136.27,54.35
  Top 0.61: 136.27,54.35 RANGE.WIPER
RATE
  Top 0.254: IC7.35 39.14,5.31 40.48,3.97 82.07,3.97 86.52,8.41 86.52,10 100.81,24.29 118.27,24.29 140.02,46.04 140.02,48.74 145.1,53.82 160.65,53.82 161.67,54.83
  Top 0.61: 161.67,54.83 RATE.WIPER
SEQ_LED_1
  Top 0.254: IC7.98 35.64,25.48 33.81,27.31 28.26,27.31 25.4,30.16 R16.2
SEQ_LED_2
  Top 0.254: IC7.97 36.14,25.77 33.97,27.94 28.42,27.94 24.29,32.07 19.84,32.07 19.21,31.43 R17.2
SEQ_LED_3
  Top 0.254: IC7.96 36.64,26.07 34.13,28.58 28.57,28.58 23.49,33.66 R18.2
SWDCLK  (via drill 0.6)
  Top 0.254: IC7.76 46.64,22.35 45.08,20.8 v41.75,20.8 | R29.1 16.83,26.67 17.46,26.04 19.05,26.04 20.16,24.92 22.54,24.92
  Top 0.406: 22.54,24.92 SWD.3
  Bottom 0.254: v41.75,20.8 41.27,20.8 38.89,18.42 32.23,18.42 28.42,22.23 25.24,22.23
  Bottom 0.406: SWD.3 25.24,22.23
SWDIO  (via drill 0.6)
  Top 0.254: IC7.72 46.89,20.22 44.29,17.62 43.18,17.62 v42.7,17.15 | R30.1 19.47,27.78 22.38,27.78
  Top 0.406: 22.38,27.78 23.81,26.35 SWD.4
  Bottom 0.254: v42.7,17.15 32.7,17.15 28.26,21.59 23.34,21.59 22.54,22.38 22.54,24.92
  Bottom 0.406: 22.54,24.92 SWD.4
SWO  (via drill 0.6)
  Top 0.254: v39.53,20.48 40.14,21.09 IC7.89 | 27.78,23.65 27.94,23.65 28.1,23.5 28.73,23.5 R28.1 28.89,23.5
  Top 0.406: SWD.5 27.78,23.65
  Bottom 0.254: v39.53,20.48 38.1,19.05 33.18,19.05 28.57,23.65
  Bottom 0.406: 28.57,23.65 SWD.5
TRIG  (via drill 0.6)
  Top 0.254: IC7.84 42.64,27.53 41.27,28.89 41.27,33.66 56.2,48.58 v56.2,64.29 | v86.2,67.15 86.2,68.26 85.84,68.62 IC11.2
  Bottom 0.254: v56.2,64.29 56.2,66.68 59.37,69.85 84.3,69.69 v86.2,67.15
TRIG_J  (via drill 0.6)
  Top 0.254: R3.2 v87.15,71.12 | v91.76,62.23 94.77,62.23 99.22,66.68 v99.22,72.23
  Bottom 0.254: v87.15,71.12 88.42,70.17 88.58,65.41 v91.76,62.23
  Bottom 0.61: v99.22,72.23 U$3.6
TUNE  (via drill 0.6)
  Top 0.254: IC7.17 39.78,13.72 v40.16,13.65 | v57.63,40.32 65.15,47.84
  Top 0.61: 65.15,47.84 TUNE.WIPER
  Bottom 0.254: v40.16,13.65 46.51,13.65 47.47,14.61 47.47,16.99 55.56,25.08 55.56,37.94 v57.63,40.32
(copper drawn outside any net)
  shapes: Top area x1

### Text on the board
tPlace: PMOD | REV C | -12V